# EAGLE design light_controller (EAGLE 8.4.3)
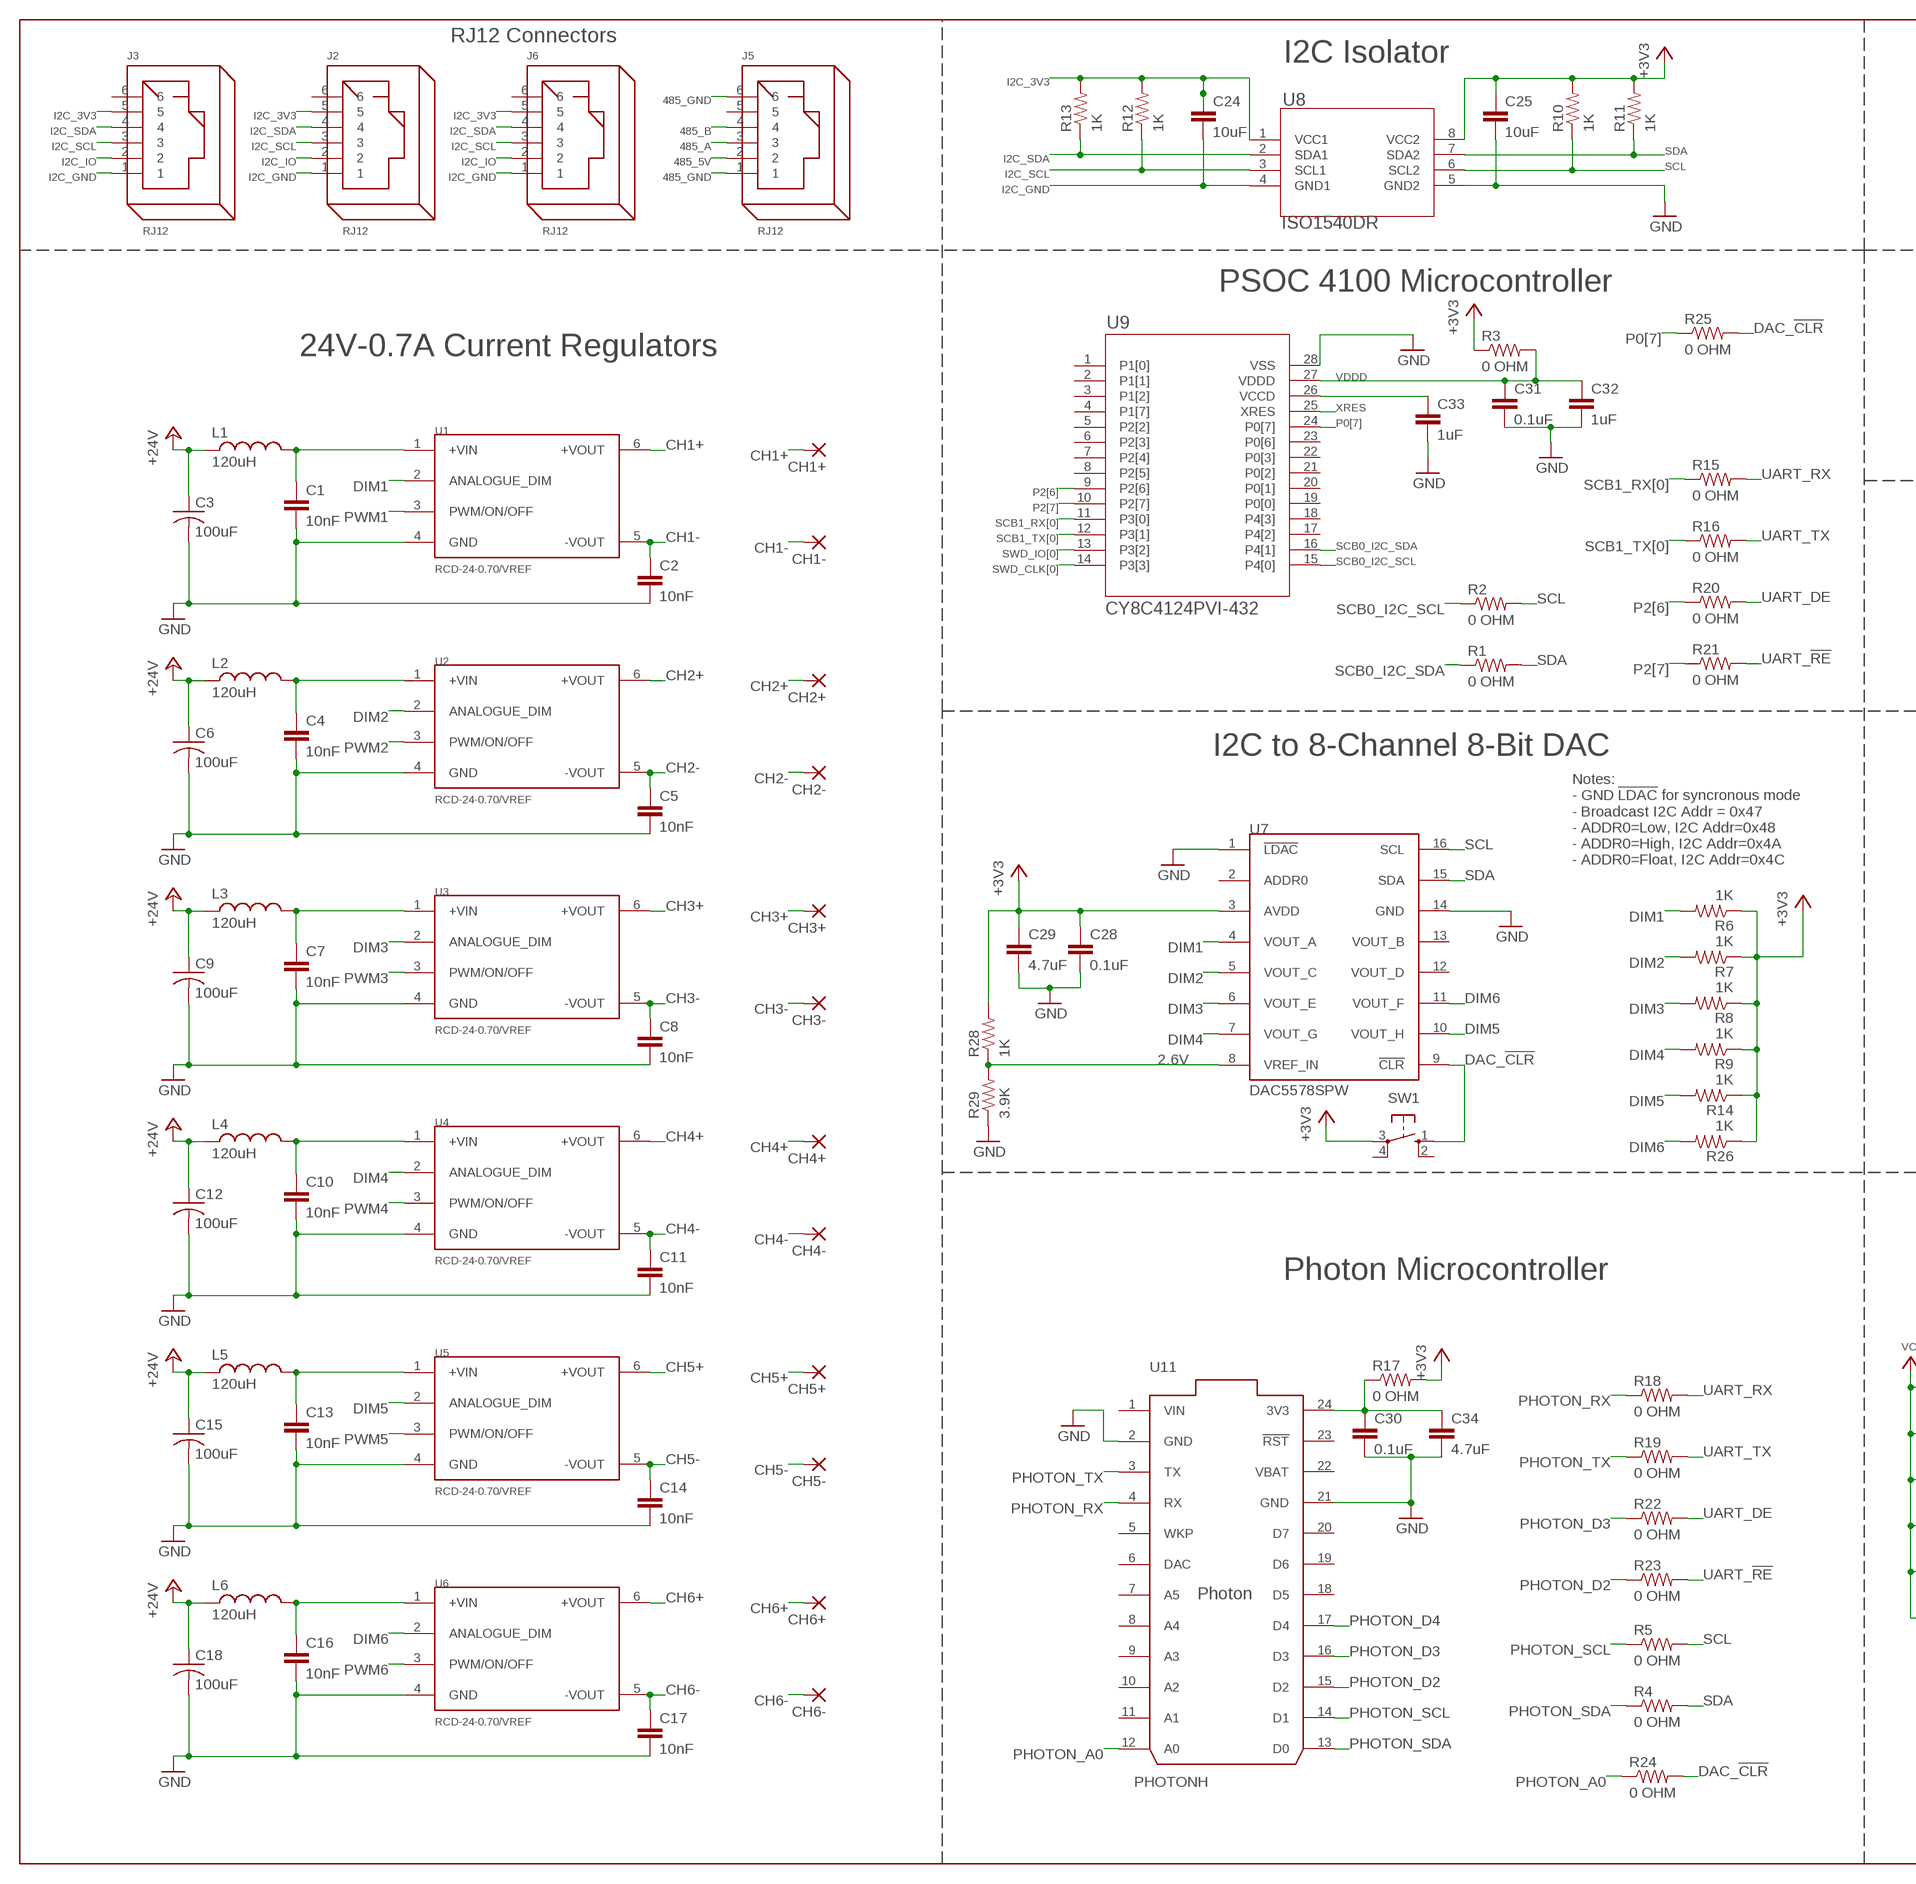
[diagram p0: schematic, sheet 1, part 1 of 2]
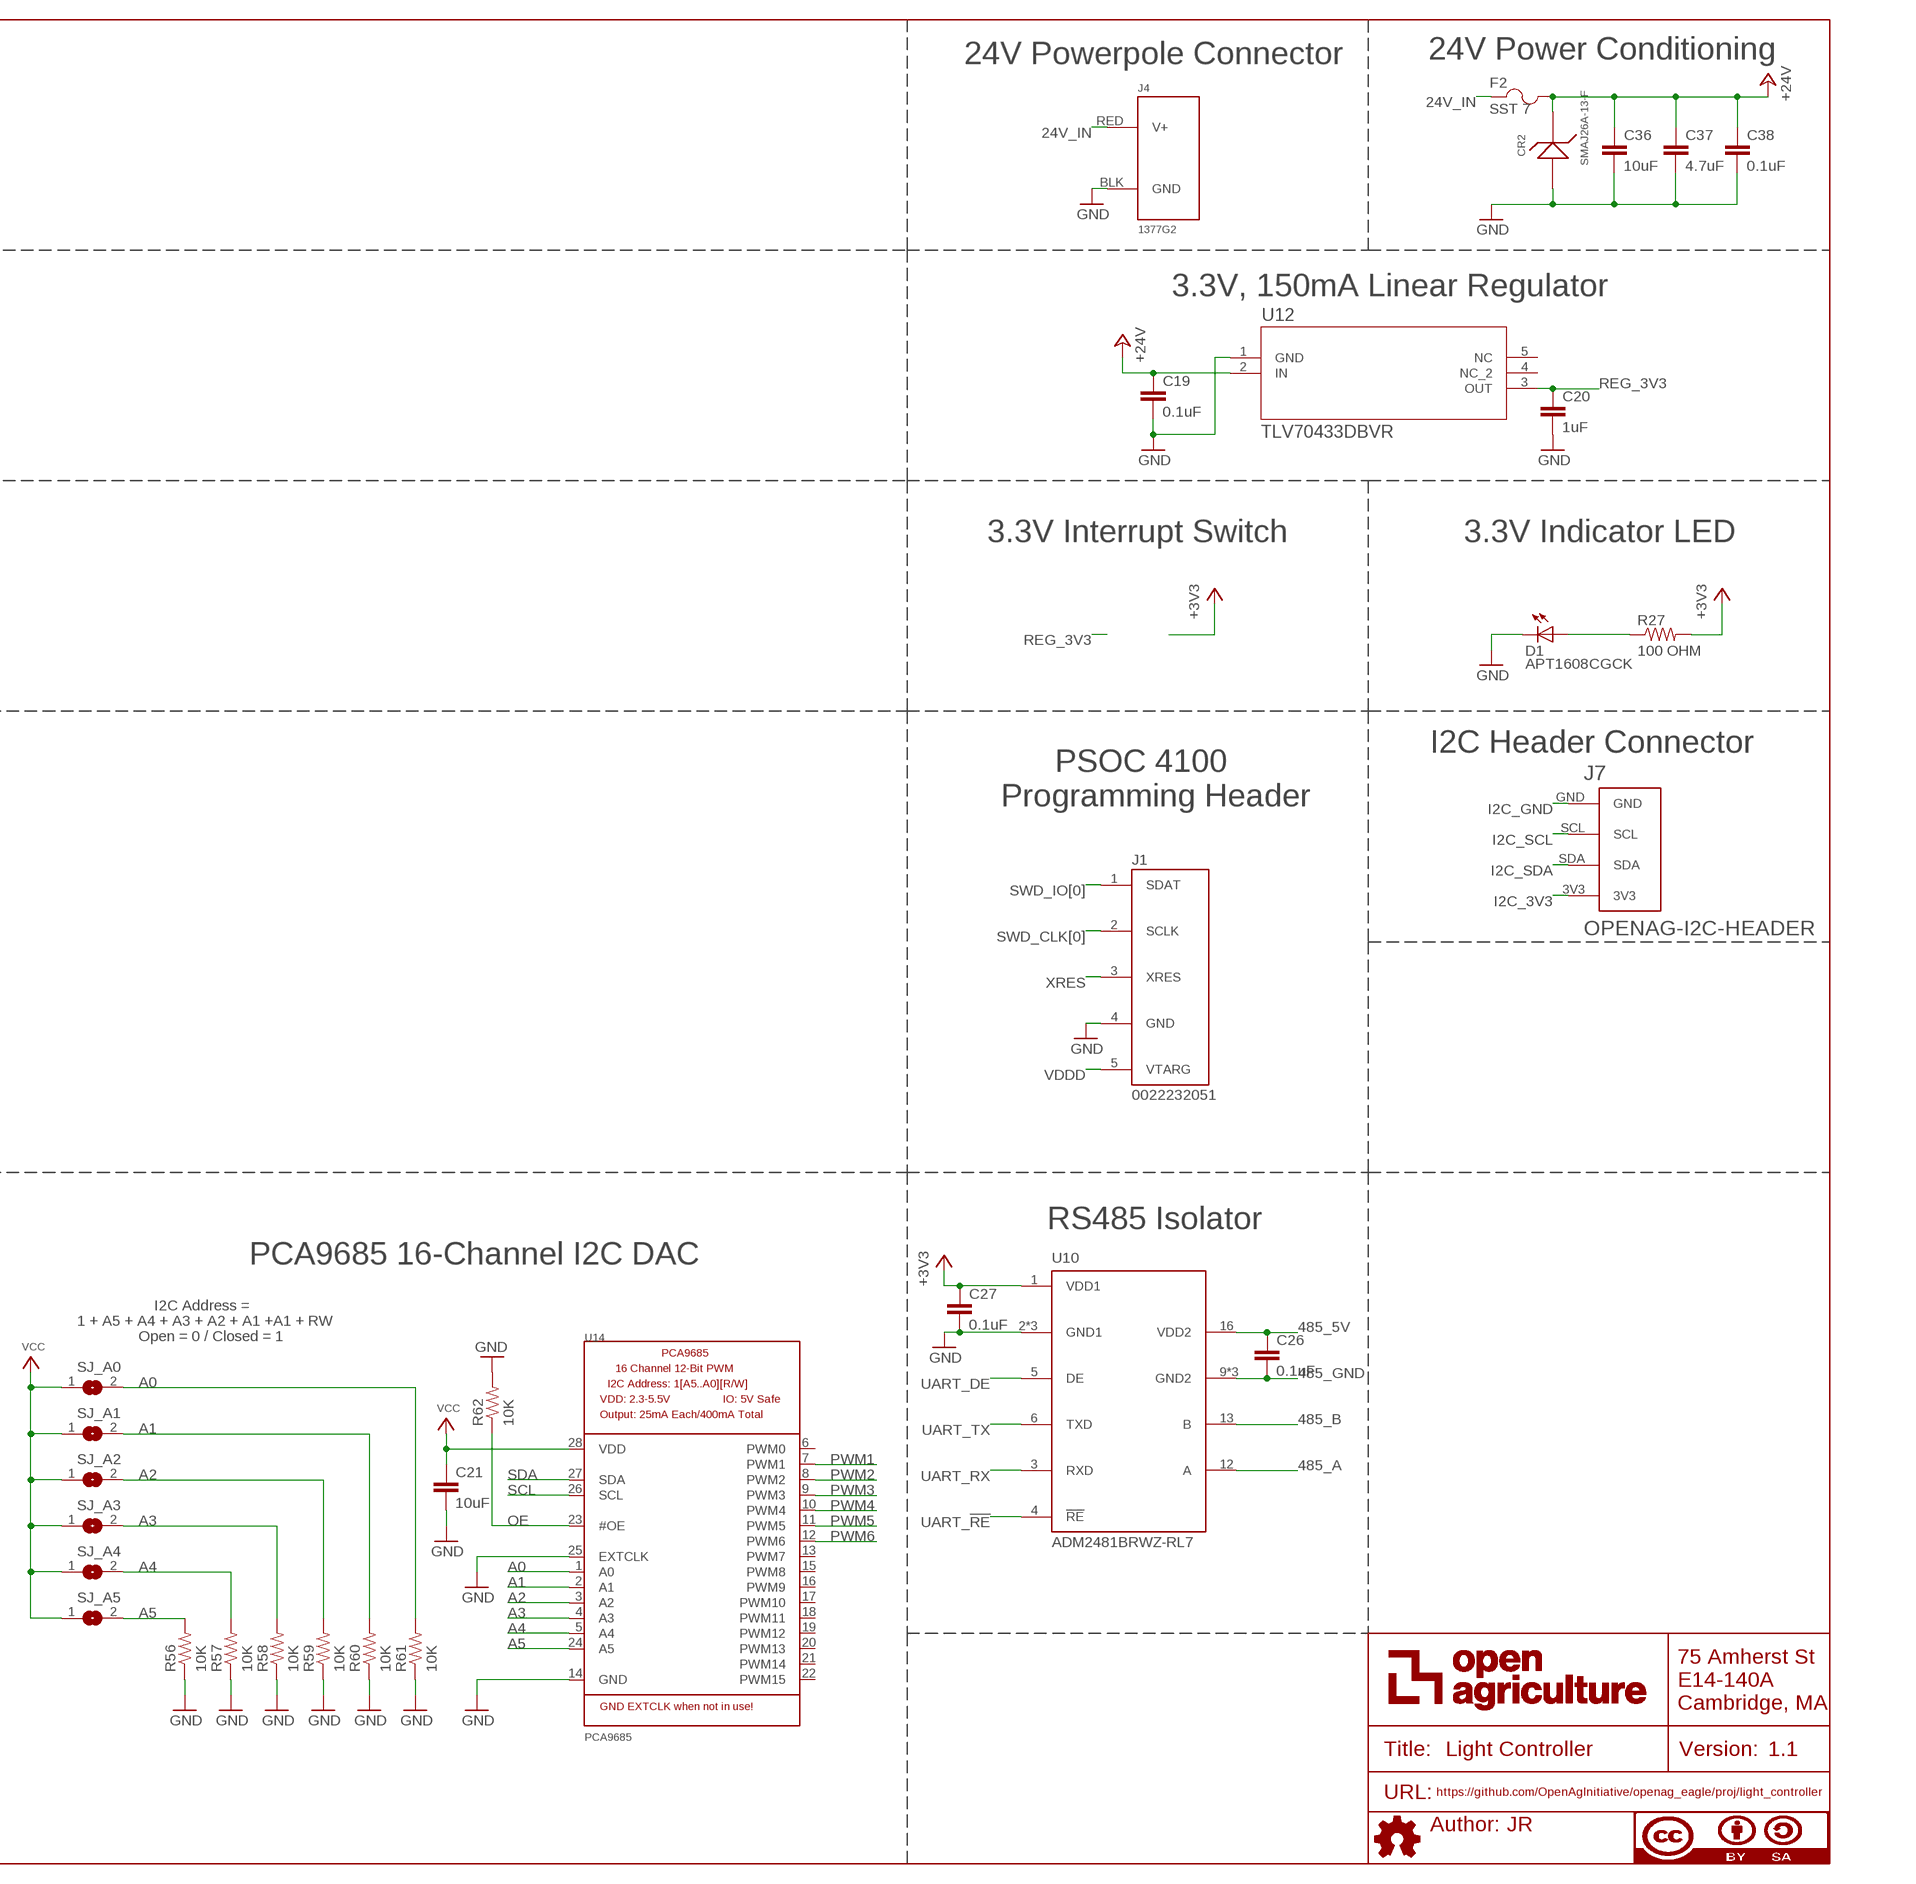
[diagram p1: schematic, sheet 1, part 2 of 2]

## Parts
C1  10nF  10NF-C0603C103K5RACTU  [C0603]
C2  10nF  10NF-C0603C103K5RACTU  [C0603]
C3  100uF  100UF-EEE-1HA101UP  [EEE-1HA101UP]
C4  10nF  10NF-C0603C103K5RACTU  [C0603]
C5  10nF  10NF-C0603C103K5RACTU  [C0603]
C6  100uF  100UF-EEE-1HA101UP  [EEE-1HA101UP]
C7  10nF  10NF-C0603C103K5RACTU  [C0603]
C8  10nF  10NF-C0603C103K5RACTU  [C0603]
C9  100uF  100UF-EEE-1HA101UP  [EEE-1HA101UP]
C10  10nF  10NF-C0603C103K5RACTU  [C0603]
C11  10nF  10NF-C0603C103K5RACTU  [C0603]
C12  100uF  100UF-EEE-1HA101UP  [EEE-1HA101UP]
C13  10nF  10NF-C0603C103K5RACTU  [C0603]
C14  10nF  10NF-C0603C103K5RACTU  [C0603]
C15  100uF  100UF-EEE-1HA101UP  [EEE-1HA101UP]
C16  10nF  10NF-C0603C103K5RACTU  [C0603]
C17  10nF  10NF-C0603C103K5RACTU  [C0603]
C18  100uF  100UF-EEE-1HA101UP  [EEE-1HA101UP]
C19  0.1uF  0.1UF-C0603C104K5RACTU  [C0603]
C20  1uF  1UF-CL10A105KB8NNNC  [C0603]
C21  10uF  10UF-GMK212BBJ106KG-T  [C0805]
C24  10uF  10UF-GMK212BBJ106KG-T  [C0805]
C25  10uF  10UF-GMK212BBJ106KG-T  [C0805]
C26  0.1uF  0.1UF-C0603C104K5RACTU  [C0603]
C27  0.1uF  0.1UF-C0603C104K5RACTU  [C0603]
C28  0.1uF  0.1UF-C0603C104K5RACTU  [C0603]
C29  4.7uF  4.7UF-CL21A475KBQNNNE  [C0805]
C30  0.1uF  0.1UF-C0603C104K5RACTU  [C0603]
C31  0.1uF  0.1UF-C0603C104K5RACTU  [C0603]
C32  1uF  1UF-CL10A105KB8NNNC  [C0603]
C33  1uF  1UF-CL10A105KB8NNNC  [C0603]
C34  4.7uF  4.7UF-CL21A475KBQNNNE  [C0805]
C36  10uF  10UF-GMK212BBJ106KG-T  [C0805]
C37  4.7uF  4.7UF-CL21A475KBQNNNE  [C0805]
C38  0.1uF  0.1UF-C0603C104K5RACTU  [C0603]
CH1+  3,17/1,3  [3,17/1,3]
CH1-  3,17/1,3  [3,17/1,3]
CH2+  3,17/1,3  [3,17/1,3]
CH2-  3,17/1,3  [3,17/1,3]
CH3+  3,17/1,3  [3,17/1,3]
CH3-  3,17/1,3  [3,17/1,3]
CH4+  3,17/1,3  [3,17/1,3]
CH4-  3,17/1,3  [3,17/1,3]
CH5+  3,17/1,3  [3,17/1,3]
CH5-  3,17/1,3  [3,17/1,3]
CH6+  3,17/1,3  [3,17/1,3]
CH6-  3,17/1,3  [3,17/1,3]
CR2  SMAJ26A-13-F  [SMA]
D1  APT1608CGCK  [CHIPLED_0603]
F2  SST 7  SST_7  [SS]
FRAME1  DOCFIELD  [DOCFIELD]
J1  0022232051  MINI-PROG3-5POS-MATING-CONNECTOR  [22-23-2051]
J2  RJ12  A-2004-1-4-LP-N-R  [RJ12]
J3  RJ12  A-2004-1-4-LP-N-R  [RJ12]
J4  1377G2  1377G21377G2  [1377G2]
J5  RJ12  A-2004-1-4-LP-N-R  [RJ12]
J6  RJ12  A-2004-1-4-LP-N-R  [RJ12]
J7  OPENAG-I2C-HEADER  [OPENAG-I2C-HEADER]
L1  120uH  120UH-74404064121  [74404064121]
L2  120uH  120UH-74404064121  [74404064121]
L3  120uH  120UH-74404064121  [74404064121]
L4  120uH  120UH-74404064121  [74404064121]
L5  120uH  120UH-74404064121  [74404064121]
L6  120uH  120UH-74404064121  [74404064121]
R1  0 OHM  0OHM-RC0603JR-070RL  [RC0603N]
R2  0 OHM  0OHM-RC0603JR-070RL  [RC0603N]
R3  0 OHM  0OHM-RC0603JR-070RL  [RC0603N]
R4  0 OHM  0OHM-RC0603JR-070RL  [RC0603N]
R5  0 OHM  0OHM-RC0603JR-070RL  [RC0603N]
R6  1K  1K-ERJ-PB3D1001V  [RC0603N]
R7  1K  1K-ERJ-PB3D1001V  [RC0603N]
R8  1K  1K-ERJ-PB3D1001V  [RC0603N]
R9  1K  1K-ERJ-PB3D1001V  [RC0603N]
R10  1K  1K-ERJ-PB3D1001V  [RC0603N]
R11  1K  1K-ERJ-PB3D1001V  [RC0603N]
R12  1K  1K-ERJ-PB3D1001V  [RC0603N]
R13  1K  1K-ERJ-PB3D1001V  [RC0603N]
R14  1K  1K-ERJ-PB3D1001V  [RC0603N]
R15  0 OHM  0OHM-RC0603JR-070RL  [RC0603N]
R16  0 OHM  0OHM-RC0603JR-070RL  [RC0603N]
R17  0 OHM  0OHM-RC0603JR-070RL  [RC0603N]
R18  0 OHM  0OHM-RC0603JR-070RL  [RC0603N]
R19  0 OHM  0OHM-RC0603JR-070RL  [RC0603N]
R20  0 OHM  0OHM-RC0603JR-070RL  [RC0603N]
R21  0 OHM  0OHM-RC0603JR-070RL  [RC0603N]
R22  0 OHM  0OHM-RC0603JR-070RL  [RC0603N]
R23  0 OHM  0OHM-RC0603JR-070RL  [RC0603N]
R24  0 OHM  0OHM-RC0603JR-070RL  [RC0603N]
R25  0 OHM  0OHM-RC0603JR-070RL  [RC0603N]
R26  1K  1K-ERJ-PB3D1001V  [RC0603N]
R27  100 OHM  100OHM-RC0603JR-07100RL  [RC0603N]
R28  1K  1K-ERJ-PB3D1001V  [RC0603N]
R29  3.9K  3.9K-RC0603JR-073K9L  [RC0603N]
R56  10K  10K-ERJ-3EKF1002V  [RC0603N]
R57  10K  10K-ERJ-3EKF1002V  [RC0603N]
R58  10K  10K-ERJ-3EKF1002V  [RC0603N]
R59  10K  10K-ERJ-3EKF1002V  [RC0603N]
R60  10K  10K-ERJ-3EKF1002V  [RC0603N]
R61  10K  10K-ERJ-3EKF1002V  [RC0603N]
R62  10K  10K-ERJ-3EKF1002V  [RC0603N]
SJ_A0  SOLDERJUMPERREFLOW_NOPASTE  [SOLDERJUMPER_REFLOW_NOPASTE]
SJ_A1  SOLDERJUMPERREFLOW_NOPASTE  [SOLDERJUMPER_REFLOW_NOPASTE]
SJ_A2  SOLDERJUMPERREFLOW_NOPASTE  [SOLDERJUMPER_REFLOW_NOPASTE]
SJ_A3  SOLDERJUMPERREFLOW_NOPASTE  [SOLDERJUMPER_REFLOW_NOPASTE]
SJ_A4  SOLDERJUMPERREFLOW_NOPASTE  [SOLDERJUMPER_REFLOW_NOPASTE]
SJ_A5  SOLDERJUMPERREFLOW_NOPASTE  [SOLDERJUMPER_REFLOW_NOPASTE]
SW1  BF3-1020  [B3F-10XX]
U1  RCD-24-0.70/VREF  [RCD-24-PINNED]
U2  RCD-24-0.70/VREF  [RCD-24-PINNED]
U3  RCD-24-0.70/VREF  [RCD-24-PINNED]
U4  RCD-24-0.70/VREF  [RCD-24-PINNED]
U5  RCD-24-0.70/VREF  [RCD-24-PINNED]
U6  RCD-24-0.70/VREF  [RCD-24-PINNED]
U7  DAC5578SPW  [TSSOP16]
U8  ISO1540DR  [D8]
U9  CY8C4124PVI-432  [SSOP-28]
U10  ADM2481BRWZ-RL7  [SOIC16LWB]
U11  PHOTONH  PHOTONHPHOTONH  [PHOTON]
U12  TLV70433DBVR  TLV70433DBVRDBV5-M  [DBV5-M]
U14  PCA9685  PCA9685PW/Q900,118  [TSSOP28]

## Nets
2.6V: R28.1 R29.2 U7.8(VREF_IN)
24V_IN: F2.1 J4.RED(V+)
485_5V: C26.1 J5.2 U10.16(VDD2)
485_A: J5.3 U10.12(A)
485_B: J5.4 U10.13(B)
485_GND: C26.2 J5.1 J5.6 U10.9(GND2) U10.10(GND2) U10.15(GND2)
+3V3: C25.1 C27.1 C28.1 C29.1 R3.1 R6.1 R7.1 R8.1 R9.1 R10.2 R11.2 R14.1 R17.2 R26.1 R27.2 R28.2 SW1.3(P) U7.3(AVDD) U8.8(VCC2) U10.1(VDD1)
+24V: C3.+(1(+)) C6.+(1(+)) C9.+(1(+)) C12.+(1(+)) C15.+(1(+)) C18.+(1(+)) C19.1 C36.1 C37.1 C38.1 CR2.1 F2.2 L1.1 L2.1 L3.1 L4.1 L5.1 L6.1 U12.2(IN)
A0: R61.2 SJ_A0.2 U14.1(A0)
A1: R60.2 SJ_A1.2 U14.2(A1)
A2: R59.2 SJ_A2.2 U14.3(A2)
A3: R58.2 SJ_A3.2 U14.4(A3)
A4: R57.2 SJ_A4.2 U14.5(A4)
A5: R56.2 SJ_A5.2 U14.24(A5)
CH1+: CH1+.1(P) U1.6(+VOUT)
CH1-: C2.1 CH1-.1(P) U1.5(-VOUT)
CH2+: CH2+.1(P) U2.6(+VOUT)
CH2-: C5.1 CH2-.1(P) U2.5(-VOUT)
CH3+: CH3+.1(P) U3.6(+VOUT)
CH3-: C8.1 CH3-.1(P) U3.5(-VOUT)
CH4+: CH4+.1(P) U4.6(+VOUT)
CH4-: C11.1 CH4-.1(P) U4.5(-VOUT)
CH5+: CH5+.1(P) U5.6(+VOUT)
CH5-: C14.1 CH5-.1(P) U5.5(-VOUT)
CH6+: CH6+.1(P) U6.6(+VOUT)
CH6-: C17.1 CH6-.1(P) U6.5(-VOUT)
DAC_!CLR!: R24.2 R25.2 SW1.1(S) U7.9(!CLR!)
DIM1: R6.2 U1.2(ANALOGUE_DIM) U7.4(VOUT_A)
DIM2: R7.2 U2.2(ANALOGUE_DIM) U7.5(VOUT_C)
DIM3: R8.2 U3.2(ANALOGUE_DIM) U7.6(VOUT_E)
DIM4: R9.2 U4.2(ANALOGUE_DIM) U7.7(VOUT_G)
DIM5: R14.2 U5.2(ANALOGUE_DIM) U7.10(VOUT_H)
DIM6: R26.2 U6.2(ANALOGUE_DIM) U7.11(VOUT_F)
GND: C1.2 C2.2 C3.-(2(-)) C4.2 C5.2 C6.-(2(-)) C7.2 C8.2 C9.-(2(-)) C10.2 C11.2 C12.-(2(-)) C13.2 C14.2 C15.-(2(-)) C16.2 C17.2 C18.-(2(-)) C19.2 C20.2 C21.2 C25.2 C27.2 C28.2 C29.2 C30.2 C31.2 C32.2 C33.2 C34.2 C36.2 C37.2 C38.2 CR2.2 D1.C J1.4(GND) J4.BLK(GND) R29.1 R56.1 R57.1 R58.1 R59.1 R60.1 R61.1 R62.2 U1.4(GND) U2.4(GND) U3.4(GND) U4.4(GND) U5.4(GND) U6.4(GND) U7.1(!LDAC!) U7.14(GND) U8.5(GND2) U9.28(VSS) U10.2(GND1) U10.7(GND1) U10.8(GND1) U11.2(GND) U11.21(GND) U12.1(GND) U14.14(GND) U14.25(EXTCLK)
I2C_3V3: C24.1 J2.5 J3.5 J6.5 J7.3V3 R12.2 R13.2 U8.1(VCC1)
I2C_GND: C24.2 J2.1 J3.1 J6.1 J7.GND U8.4(GND1)
I2C_IO: J2.2 J3.2 J6.2
I2C_SCL: J2.3 J3.3 J6.3 J7.SCL R12.1 U8.3(SCL1)
I2C_SDA: J2.4 J3.4 J6.4 J7.SDA R13.1 U8.2(SDA1)
N$1: C1.1 L1.2 U1.1(+VIN)
N$2: C4.1 L2.2 U2.1(+VIN)
N$3: D1.A R27.1
N$4: C7.1 L3.2 U3.1(+VIN)
N$5: C10.1 L4.2 U4.1(+VIN)
N$6: C13.1 L5.2 U5.1(+VIN)
N$7: C16.1 L6.2 U6.1(+VIN)
N$8: C30.1 C34.1 R17.1 U11.24(3V3)
N$23: C33.1 U9.26(VCCD)
OE: R62.1 U14.23(#OE)
P0[7]: R25.1 U9.24(P0[7])
P2[6]: R20.1 U9.9(P2[6])
P2[7]: R21.1 U9.10(P2[7])
PHOTON_A0: R24.1 U11.12(A0)
PHOTON_D2: R23.1 U11.15(D2)
PHOTON_D3: R22.1 U11.16(D3)
PHOTON_D4: U11.17(D4)
PHOTON_RX: R18.1 U11.4(RX)
PHOTON_SCL: R5.1 U11.14(D1)
PHOTON_SDA: R4.1 U11.13(D0)
PHOTON_TX: R19.1 U11.3(TX)
PWM1: U1.3(PWM/ON/OFF) U14.7(PWM1)
PWM2: U2.3(PWM/ON/OFF) U14.8(PWM2)
PWM3: U3.3(PWM/ON/OFF) U14.9(PWM3)
PWM4: U4.3(PWM/ON/OFF) U14.10(PWM4)
PWM5: U5.3(PWM/ON/OFF) U14.11(PWM5)
PWM6: U6.3(PWM/ON/OFF) U14.12(PWM6)
REG_3V3: C20.1 U12.3(OUT)
SCB0_I2C_SCL: R2.1 U9.15(P4[0])
SCB0_I2C_SDA: R1.1 U9.16(P4[1])
SCB1_RX[0]: R15.1 U9.11(P3[0])
SCB1_TX[0]: R16.1 U9.12(P3[1])
SCL: R2.2 R5.2 R10.1 U7.16(SCL) U8.6(SCL2) U14.26(SCL)
SDA: R1.2 R4.2 R11.1 U7.15(SDA) U8.7(SDA2) U14.27(SDA)
SWD_CLK[0]: J1.2(SCLK) U9.14(P3[3])
SWD_IO[0]: J1.1(SDAT) U9.13(P3[2])
UART_!RE!: R21.2 R23.2 U10.4(!RE!)
UART_DE: R20.2 R22.2 U10.5(DE)
UART_RX: R15.2 R18.2 U10.3(RXD)
UART_TX: R16.2 R19.2 U10.6(TXD)
VCC: C21.1 SJ_A0.1 SJ_A1.1 SJ_A2.1 SJ_A3.1 SJ_A4.1 SJ_A5.1 U14.28(VDD)
VDDD: C31.1 C32.1 J1.5(VTARG) R3.2 U9.27(VDDD)
XRES: J1.3(XRES) U9.25(XRES)
Unconnected: J2.6 J3.6 J5.5 J6.6 SW1.2(S1) SW1.4(P1) U7.2(ADDR0) U7.12(VOUT_D) U7.13(VOUT_B) U9.1(P1[0]) U9.2(P1[1]) U9.3(P1[2]) U9.4(P1[7]) U9.5(P2[2]) U9.6(P2[3]) U9.7(P2[4]) U9.8(P2[5]) U9.17(P4[2]) U9.18(P4[3]) U9.19(P0[0]) U9.20(P0[1]) U9.21(P0[2]) U9.22(P0[3]) U9.23(P0[6]) U11.5(WKP) U11.6(DAC) U11.7(A5) U11.8(A4) U11.9(A3) U11.10(A2) U11.11(A1) U11.18(D5) U11.19(D6) U11.20(D7) U11.23(!RST) U12.4(NC_2) U12.5(NC) U14.6(PWM0) U14.13(PWM7) U14.15(PWM8) U14.16(PWM9) U14.17(PWM10) U14.18(PWM11) U14.19(PWM12) U14.20(PWM13) U14.21(PWM14) U14.22(PWM15)

## Notes on the sheet
- RJ12 Connectors
- I2C Isolator | 24V Powerpole Connector | 24V Power Conditioning
- PSOC 4100 Microcontroller | 3.3V, 150mA Linear Regulator
- 24V-0.7A Current Regulators
- 3.3V Interrupt Switch | 3.3V Indicator LED
- I2C to 8-Channel 8-Bit DAC | I2C Header Connector
- PSOC 4100 
  Programming Header
- Notes:
  - GND !LDAC! for syncronous mode
  - Broadcast I2C Addr = 0x47
  - ADDR0=Low, I2C Addr=0x48
  - ADDR0=High, I2C Addr=0x4A
  - ADDR0=Float, I2C Addr=0x4C
- RS485 Isolator
- PCA9685 16-Channel I2C DAC
- Photon Microcontroller
- I2C Address =
- 1 + A5 + A4 + A3 + A2 + A1 +A1 + RW
- Open = 0 / Closed = 1

## Power pins joined to a net without a drawn wire
VBAT: U11.22(VBAT)
VIN: U11.1(VIN)

## Library data of the parts
C1 C2 C4 C5 C7 C8 C10 C11 C13 C14 C16 C17 = openag-capacitors:10NF-C0603C103K5RACTU: KEMET - C0603C103K5RACTU - CAP CER 10000PF 50V X7R 0603 Description: 10000pF ±10% 50V Ceramic Capacitor X7R 0603 (1608 Metric) Technical Specifications: Capacitance: 10000pF Tolerance: ±10% Voltage - Rated: 50V Temperature Coefficient: X7R Operating Temperature: -55°C ~ 125°C Applications: General Purpose Mounting Type: Surface Mount, MLCC Package / Case: 0603 (1608 Metric) Size / Dimension: 0.063" L x 0.032" W (1.60mm x 0.80mm) Thickness (Max): 0.034" (0.87mm) Datasheet(s): X7R Dielectric, 6.3-250 VDC <https://search.kemet.com/component-edge/download/datasheet/C0603C103K5RACTU.pdf> Vendor(s): Digikey: 399-1091-1-ND <https://www.digikey.com/product-detail/en/kemet/C0603C103K5RACTU/399-1091-1-ND/411366#>; POPULATE: YES; VERIFIED: NO
C3 C6 C9 C12 C15 C18 = openag-capacitors:100UF-EEE-1HA101UP: Panasonic - EEE-1HA101UP - ELECTROLYTIC CAP ALUM 100UF 20% 50V SMD Description: 100µF 50V Aluminum Electrolytic Capacitors Radial, Can - SMD 2000 Hrs @ 85°C Technical Specifications: Capacitance: 100uF Tolerance: ±20% Rated Voltage: 50V Polarization: Polar Operating Temperature: -40°C ~ 85°C Datasheet(s): S Series, Type V <https://industrial.panasonic.com/cdbs/www-data/pdf/RDE0000/ABA0000C1145.pdf> Vendor(s): Digikey: PCE3917CT-ND <https://www.digikey.com/product-detail/en/panasonic-electronic-components/EEE-1HA101UP/PCE3917CT-ND/766293>; POPULATE: YES; VERIFIED: NO
C19 C26-C28 C30 C31 C38 = openag-capacitors:0.1UF-C0603C104K5RACTU: Kemet - C0603C104K5RACTU - CAP CER 0.1UF 50V X7R 0603 Description: 0.1µF ±10% 50V Ceramic Capacitor X7R 0603 (1608 Metric) Technical Specifications: Capacitance: 0.1µF Tolerance: ±10% Rated Voltage: 50V Temperature Coefficient: X7R Operating Temperature: -55°C ~ 125°C Package / Case: 0603 (1608 Metric) Datasheet(s): X7R Dielectric, 6.3-250 VDC <https://search.kemet.com/component-edge/download/datasheet/C0603C104K5RACTU.pdf> Vendor(s): Digikey: 399-5089-1-ND <https://www.digikey.com/product-detail/en/kemet/C0603C104K5RACTU/399-5089-1-ND/1465623>; POPULATE: YES; VERIFIED: NO
C20 C32 C33 = openag-capacitors:1UF-CL10A105KB8NNNC: Samsung - CL10A105KB8NNNC - CAP CER 1UF 50V X5R 0603 Description: 1µF ±10% 50V Ceramic Capacitor X5R 0603 (1608 Metric) Technical Specifications: Capacitance: 1µF Tolerance: ±10% Rated Voltage: 50V Temperature Coefficient: X5R Operating Temperature: -55°C ~ 85°C Packaging / Case: 0603 (1608 Metric) Datasheet(s): CL10A105KB8NNNC Spec <http://www.samsungsem.com/kr/support/product-search/mlcc/CL10A105KB8NNNC.jsp> Vendor(s): Digikey: 1276-1860-1-ND <https://www.digikey.com/product-detail/en/samsung-electro-mechanics-america-inc/CL10A105KB8NNNC/1276-1860-1-ND/3889946>; POPULATE: YES; VERIFIED: NO
C21 C24 C25 C36 = openag-capacitors:10UF-GMK212BBJ106KG-T: Taiyo Yuden - GMK212BBJ106KG-T - CAP CER 10UF 35V X5R 0805 Description: 10µF ±10% 35V Ceramic Capacitor X5R 0805 (2012 Metric) Technical Specifications: Capacitance: 10µF Tolerance: ±10% Rated Voltage: 35V Temperature Coefficient: X5R Operating Temperature: -55°C ~ 85°C Package / Case: 0805 (2012 Metric) Datasheet(s): GMK212BBJ106KG-T Spec <http://ds.yuden.co.jp/TYCOMPAS/ut/detail.do?productNo=GMK212BBJ106KG-T&fileName=GMK212BBJ106KG-T_SS&mode=specSheetDownload> Vendor(s): Digikey: 587-4893-1-ND <https://www.digikey.com/product-detail/en/taiyo-yuden/GMK212BBJ106KG-T/587-4893-1-ND/6563736>; POPULATE: YES; VERIFIED: NO
C29 C34 C37 = openag-capacitors:4.7UF-CL21A475KBQNNNE: Samsung - CL21A475KBQNNNE - CAP CER 4.7UF 50V X5R 0805 Description: 4.7µF ±10% 50V Ceramic Capacitor X5R 0805 (2012 Metric) Technical Specifications: Capacitance: 4.7uF Tolerance: ±10% Rated Voltage: 50V Temperature Coefficient: X5R Operating Temperature: -55°C ~ 85°C Package/Case: 0805 (2012 Metric) Datasheet(s): CL21A475KBQNNNE Characteristics <http://www.samsungsem.com/kr/front/downloadcms.do?path=/kr/support/product-search/mlcc/__icsFiles/afieldfile/2014/11/05&fileName=C_CL21A475KBQNNNE.pdf> Vendor(s): Digikey: 1276-1248-1-ND <https://www.digikey.com/product-detail/en/samsung-electro-mechanics/CL21A475KBQNNNE/1276-1248-1-ND/3889334>; POPULATE: YES; VERIFIED: NO
CH1+ CH1- CH2+ CH2- CH3+ CH3- CH4+ CH4- CH5+ CH5- CH6+ CH6- = openag-wirepads:3,17/1,3: THROUGH-HOLE PAD
CR2 = openag-diodes:SMAJ26A-13-F: Diodes Incorporated - SMAJ26A-13-F - TVS DIODE 26VWM 42.1VC SMA Description: TVS DIODE 26VWM 42.1VC SMA Technical Specifications: Type: Zener Voltage - Reverse Standoff (Typ): 26V Voltage - Breakdown (Min): 28.9V Voltage - Clamping (Max) @ Ipp: 42.1V Current - Peak Pulse (10/1000µs): 9.5A Power - Peak Pulse: 400W Power Line Protection: No Operating Temperature: -55°C ~ 150°C (TJ) DO-214AC, SMA Datasheet(s): SMAJ5.0(C)A - SMAJ200(C)A Vendor(s): Digikey: SMAJ26A-FDICT-ND <https://www.digikey.com/product-detail/en/diodes-incorporated/SMAJ26A-13-F/SMAJ26A-FDICT-ND/806583>; POPULATE: YES; VERIFIED: NO
D1 = openag-diodes:APT1608CGCK: Kingbright - APT1608CGCK - LED GREEN CLEAR 0603 SMD Description: Green 570nm LED Indication - Discrete 2.1V 0603 (1608 Metric) Technical Specifications: Color: Green Lens Color: Colorless Lens Transparency: Clear Millicandela Rating: 50mcd Lens Style/Size: Rectangle with Flat Top, 1.20mm x 0.80mm Voltage - Forward (Vf) (Typ): 2.1V Current - Test: 20mA Viewing Angle: 120° Mounting Type: Surface Mount Wavelength - Dominant: 570nm Wavelength - Peak: 574nm Package / Case: 0603 (1608 Metric) Supplier Device Package: Chip LED Size / Dimension: 1.60mm L x 0.80mm W Height (Max): 0.75mm Datasheet(s): APT1608CGCK <http://www.kingbrightusa.com/images/catalog/SPEC/APT1608CGCK.pdf> Vendor(s): Digikey: 754-1116-1-ND <https://www.digikey.com/product-detail/en/kingbright/APT1608CGCK/754-1116-1-ND/1747833#>; POPULATE: YES; VERIFIED: NO
F2 = openag-fuses:SST_7: Bel Fuse - SST7 - FUSE BRD MNT 7A 125VAC/VDC 2SMD Description: FUSE BRD MNT 7A 125VAC/VDC 2SMD Technical Specifications: Current Rating: 7A Voltage Rating: 125V Fuse Type: Board Mount (Cartridge Style Excluded) Mounting Type: Surface Mount Operating Temperature: -55°C ~ 125°C Datasheet(s): SST Type <https://belfuse.com/resources/StewartConnector/SST.pdf> Vendor(s): Digikey: 507-1072-1-ND <https://www.digikey.com/product-detail/en/bel-fuse-inc/SST-7/507-1072-1-ND/615026>; POPULATE: YES; VERIFIED: NO
FRAME1 = openag-frames:DOCFIELD: DOCUMENT FIELD; AUTHOR: JR; TITLE: Light Controller; URL: https://github.com/OpenAgInitiative/openag_eagle/proj/light_controller; VER: 1.1
J1 = openag-connectors:MINI-PROG3-5POS-MATING-CONNECTOR: Molex - 0022232051 - CONN HEADER 5POS .100 VERT TIN Description: 5 Positions Header Connector 0.100" (2.54mm) Through Hole Tin This is the specified mating connector for programming a PSOC microcontroller with the MiniProg3 Programmer Technical Specifications: Connector Type: Header Contact Type: Male Pin Pitch - Mating: 0.100" (2.54mm) Number of Positions: 5 Number of Rows: 1 Mounting Type: Through Hole Fastening Type: Friction Lock Datasheet(s): Molex 22-23-2051 <http://www.molex.com/pdm_docs/sd/022232051_sd.pdf> Cypress CY8CKIT-002 Brief <http://www.cypress.com/file/44091/download> Vendor(s): Digikey: WM4203-ND (Molex Connector) <https://www.digikey.com/products/en?keywords=22-23-2051> Digikey: 428-2975-ND (Cypress Programmer Kit) <https://www.digikey.com/product-detail/en/cypress-semiconductor-corp/CY8CKIT-002/428-2975-ND/2126344>; POPULATE: YES; VERIFIED: NO
J2 J3 J5 J6 = openag-connectors:A-2004-1-4-LP-N-R: Assmann WSW Components - A-2004-1-4-LP-N-R - RJ12 CONN MOD JACK 6P6C R/A UNSHLD Description: Jack Modular Connector 6p6c (RJ11, RJ12, RJ14, RJ25) 90° Angle (Right) Unshielded Technical Specifications: Connector Type: Jack Number of Positions/Contacts: 6p6c (RJ11, RJ12, RJ14, RJ25) Number of Ports: 1 Number of Rows: 1 Mounting Type: Through Hole Orientation: 90° Angle (Right) Termination: Solder Shielding: Unshielded Features: Board Lock LED Color: Does Not Contain LED Tab Direction: Down Contact Material: Phosphor Bronze Contact Finish: Gold Contact Finish Thickness: 6µin (0.152µm) Housing Material: Polybutylene Terephthalate (PBT), Glass Filled Operating Temperature: -40°C ~ 85°C Datasheet(s): A-2004-1-4-LP-N Drawing <http://www.assmann-wsw.com/fileadmin/datasheets/ASS_7320_CO.pdf> Vendor(s): Digikey: AE10383-ND <https://www.digikey.com/product-detail/en/assmann-wsw-components/A-2004-1-4-LP-N-R/AE10383-ND/2183634>; POPULATE: YES; VERIFIED: NO
J4 = openag-connectors:1377G2: Anderson Powerpole - 1377G2 - RT. ANGLE 25A THRU-HOLE PCB CONTACT PAIR FOR 15/45 HOUSING Description: Heavy Duty Power Connectors PP PCB .40/1.295 RT.ANG.CONT. short one Technical Specifications: Current Rating: 25A Voltage Rating: 600 V Datasheet(s): 1377G2 Datasheet <http://www.mouser.com/ds/2/22/ds-pp1545-766098.pdf> Vendor(s): Mouser: 879-1377G2 <https://www.mouser.com/ProductDetail/Anderson-Power-Products/1377G2/?qs=sGAEpiMZZMtjzVbpKqo2YZRH3O%252bLIhj7rfgcv2%2febyE%3d>; POPULATE: YES; VERIFIED: NO
J7 = openag-connectors:OPENAG-I2C-HEADER: Fits standard 100 mil header footprint; POPULATE: NO; VERIFIED: NO
L1-L6 = openag-inductors:120UH-74404064121: Wurth Electronics - 74404064121 - FIXED IND 120UH 790MA 520 MOHM Technical Specifications: Inductance: 120uH Rated Current: 790mA Saturation Current: 980mA DC Resistance: 520mΩ Operating Temperature: -40° C to 125°C Datasheet(s): 74404064121 Drawing <http://katalog.we-online.de/pbs/datasheet/74404064121.pdf> Vendors: Digikey: 732-7258-1-ND <https://www.digikey.com/product-detail/en/wurth-electronics-inc/74404064121/732-7258-1-ND/5353238>; POPULATE: YES; VERIFIED: NO
R1-R5 R15-R25 = openag-resistors:0OHM-RC0603JR-070RL: Yageo - RC0603JR-070RL - RES SMD 0 OHM JUMPER 1/10W 0603 Description: 0 Ohms Jumper 0.1W, 1/10W Chip Resistor 0603 (1608 Metric) Moisture Resistant Thick Film Technical Specifications: Resistance: 0 Ohms Power: 0.1W, 1/10W Operating Temperature: -55°C ~ 155°C Package / Case: 0603 (1608 Metric) Datasheet(s): RC Series, L Datasheet <http://www.yageo.com/documents/recent/PYu-RC_Group_51_RoHS_L_8.pdf> Vendor(s): Digikey: 311-0.0GRCT-ND <https://www.digikey.com/product-detail/en/yageo/RC0603JR-070RL/311-0.0GRCT-ND/729622>; POPULATE: YES; VERIFIED: NO
R6-R14 R26 R28 = openag-resistors:1K-ERJ-PB3D1001V: Panasonic - P20283CT-ND - RES SMD 1K OHM 0.5% 1/5W 0603 Description: 1 kOhms ±0.5% 0.2W, 1/5W Chip Resistor 0603 (1608 Metric) Automotive AEC-Q200, Pulse Withstanding Thick Film Technical Specifications: Resistance: 1 kOhms Tolerance: ±0.5% Power: 0.2W, 1/5W Operating Temperature: -55°C ~ 155°C Package / Case: 0603 (1608 Metric) Datasheet(s): ERJ-PB3, PB6 Series, High Precision Datasheet <https://industrial.panasonic.com/cdbs/www-data/pdf/RDM0000/AOA0000C328.pdf> Vendor(s): Digikey: P20283CT-ND <https://www.digikey.com/product-detail/en/panasonic-electronic-components/ERJ-PB3D1001V/P20283CT-ND/6214538>; POPULATE: YES; VERIFIED: NO
R27 = openag-resistors:100OHM-RC0603JR-07100RL: Yageo - RC0603JR-07100RL - RES SMD 100 OHM 5% 1/10W 0603 Description: 100 Ohms ±5% 0.1W, 1/10W Chip Resistor 0603 (1608 Metric) Moisture Resistant Thick Film Technical Specifications: Resistance: 100 Ohms Tolerance: ±5% Power (Watts): 0.1W, 1/10W Composition: Thick Film Features: Moisture Resistant Temperature Coefficient: ±100ppm/°C Operating Temperature: -55°C ~ 155°C Package / Case: 0603 (1608 Metric) Supplier Device Package: 0603 Size / Dimension: 0.063" L x 0.032" W (1.60mm x 0.80mm) Height - Seated (Max): 0.022" (0.55mm) Number of Terminations: 2 Datasheet(s): Thick Film Chip Resistor Intro <http://www.yageo.com.tw/exep/pages/download/literatures/PYu-R_INT-thick_7.pdf> Chip Resistor Marking <http://www.yageo.com/exep/pages/download/literatures/PYu-R_Marking_2.pdf> RC Series, L Datasheet <http://www.yageo.com/documents/recent/PYu-RC_Group_51_RoHS_L_8.pdf> Vendor(s): Digikey: 311-100GRCT-ND <https://www.digikey.com/product-detail/en/yageo/RC0603JR-07100RL/311-100GRCT-ND/729644>; POPULATE: YES; VERIFIED: NO
R29 = openag-resistors:3.9K-RC0603JR-073K9L: Yageo - RC0603JR-073K9L - RES SMD 3.9K OHM 5% 1/10W 0603 Description: 3.9 kOhms ±5% 0.1W, 1/10W Chip Resistor 0603 (1608 Metric) Moisture Resistant Thick Film Technical Specifications: Resistance: 3.9 kOhms Tolerance: ±5% Power (Watts): 0.1W, 1/10W Composition: Thick Film Features: Moisture Resistant Temperature Coefficient: ±100ppm/°C Operating Temperature: -55°C ~ 155°C Package / Case: 0603 (1608 Metric) Supplier Device Package: 0603 Size / Dimension: 0.063" L x 0.032" W (1.60mm x 0.80mm) Height - Seated (Max): 0.022" (0.55mm) Number of Terminations: 2 Datasheet(s): Thick Film Chip Resistor Intro <http://www.yageo.com.tw/exep/pages/download/literatures/PYu-R_INT-thick_7.pdf> Chip Resistor Marking <http://www.yageo.com/exep/pages/download/literatures/PYu-R_Marking_2.pdf> RC Series, L Datasheet <http://www.yageo.com/documents/recent/PYu-RC_Group_51_RoHS_L_8.pdf> Vendor(s): Digikey: 311-3.9KGRCT-ND <https://www.digikey.com/product-detail/en/yageo/RC0603JR-073K9L/311-3.9KGRCT-ND/729710>; POPULATE: YES; VERIFIED: NO
R56-R62 = openag-resistors:10K-ERJ-3EKF1002V: Panasonic - ERJ-3EKF1002V - RES SMD 10K OHM 1% 1/10W 0603 Description: 10 kOhms ±1% 0.1W, 1/10W Chip Resistor 0603 (1608 Metric) Automotive AEC-Q200 Thick Film Technical Specifications: Resistance: 10kOhms Tolerance: ±1% Power: 0.1W, 1/10W Operating Temperature: -55°C ~ 155°C Package/Case: 0603 (1608 Metric) Datasheet(s): ERJ-3EKF1002V View All Specifications <https://industrial.panasonic.com/ww/products/resistors/chip-resistors/general-purpose-chip-resistors/precision-thick-film-chip-resistors/ERJ3EKF1002V> Vendor(s): Digikey: P10.0KHCT-ND <https://www.digikey.com/product-detail/en/panasonic-electronic-components/ERJ-3EKF1002V/P10.0KHCT-ND/198102>; POPULATE: YES; VERIFIED: NO
SJ_A0 SJ_A1-SJ_A5 = openag-connectors:SOLDERJUMPER: SMD Solder JUMPER Solder the two pads together to create a connection, or remove the solder to break it. REFLOW - Use this footprint for solder paste and reflow ovens. WAVE - Use this footprint for hand-soldering (larger pads). CLOSED - Has a trace between the two pads to ensure it is closed by default. The trace needs to be cut to disable the jumper, and can be closed again by creating a solder bridge between the two pads.; POPULATE: YES; VERIFIED: NO
SW1 = openag-switches:BF3-1020: Omron - BF3-1020 -SWITCH TACTILE SPST-NO 0.05A 24V Description: Tactile Switch SPST-NO Top Actuated Through Hole Technical Specifications: Circuit: SPST-NO Switch Function: Off-Mom Contact Rating @ Voltage: 0.05A @ 24VDC Mounting Type: Through Hole Switch Travel: 0.25mm Mechanical Life: 1,000,000 Cycles Operating Temperature: -25°C ~ 70°C Datasheet(s): B3F Series Datasheet <http://omronfs.omron.com/en_US/ecb/products/pdf/en-b3f.pdf> Vendor(s): Digikey: SW402-ND <https://www.digikey.com/products/en?keywords=B3F-1020>; POPULATE: YES; VERIFIED: NO
U1-U6 = openag-regulators:RCD-24-0.70/VREF: Recom Power - RCD-24-0.70/VREF - LED SUPPLY CC BUCK 2-35V 700MA Description: 700mA 2 ~ 35 V Constant Current LED Driver Buck Topology 1 Output Technical Specifications: Type: Constant Current Topology: Buck Number of Outputs: 1 Voltage - Input (Min): 4.5V Voltage - Input (Max): 36V Voltage - Output: 2 ~ 35 V Current - Output (Max): 700mA Power (Watts): 25W Dimming: Analog Features: SCP Operating Temperature: -40°C ~ 71°C Efficiency: 96% Mounting Type: Through Hole Package / Case: 6-DIP Module Size / Dimension: 0.87" L x 0.49" W x 0.33" H (22.1mm x 12.6mm x 8.5mm) Approvals: cULus Weight: 0.01 lb (4.54g) Datasheet(s): RCD-24 Series Datasheet <https://www.recom-power.com/pdf/Lightline/RCD-24.pdf> Vendor(s): Digikey: 945-1806-5-ND <https://www.digikey.com/product-detail/en/recom-power/RCD-24-0.70-VREF/945-1806-5-ND/2613767>; POPULATE: YES; VERIFIED: NO
U7 = openag-dacs:DAC5578SPW: Texas Instruments - DAC5578SPW Description: 8 Bit Digital to Analog Converter 8 16-TSSOP Technical Specifications: Number of Bits: 8-bit Number of D/A Converters: 8 Settling Time: 12us Operating Voltage: 2.7V - 5.5V Operating Temperature: -40° C to 125°C Max IDD (Normal Mode): 1.4mA Output Short Circuit Current (Individual): 25mA Datasheet(s): DAC5578,6578,7578 <http://www.ti.com/lit/ds/symlink/dac5578.pdf> Vendor(s): Digikey: 296-27736-5-ND <https://www.digikey.com/product-detail/en/texas-instruments/DAC5578SPW/296-27736-5-ND/2360827>; POPULATE: YES; VERIFIED: NO
U8 = openag-isolators:ISO1540DR: Texas Instruments - ISO1540DR - DGTL ISO 2.5KV 2CH I2C 8SOIC Description: I²C Digital Isolator 2500Vrms 2 Channel 1Mbps 25kV/µs CMTI 8-SOIC (0.154", 3.90mm Width) Technical Specifications: Technology: Capacitive Coupling Type: I²C Number of Channels: 2 Channel Type: Bidirectional Voltage-Isolation: 2500Vrms Voltage - Supply: 3 V ~ 5.5 V Data Rate: 1Mbps Operating Temperature: -40°C ~ 125°C Package / Case: 8-SOIC (0.154", 3.90mm Width) Max Supply Current (3V ≤ VCC1, VCC2 ≤ 3.6V) Side 1, Side 2: 3.8mA, 3.1mA Datasheet(s): ISO154x <http://www.ti.com/lit/ds/symlink/iso1540.pdf> Vendor(s): Digikey: 296-34871-1-ND <https://www.digikey.com/product-detail/en/texas-instruments/ISO1540DR/296-34871-1-ND/3587214>; POPULATE: YES; VERIFIED: NO
U9 = openag-microcontrollers:CY8C4124PVI-432: Cypress - CY8C4124PVI-432 - IC MCU 32BIT 16KB FLASH 28SSOP Description: ARM® Cortex®-M0 PSOC® 4 CY8C41xx Microcontroller IC 32-Bit 24MHz 16KB (16K x 8) FLASH 28-SSOP Technical Specifications: Core Processor: ARM® Cortex®-M0 Core Size: 32-Bit Core Speed: 24 MHz Connectivity: I²C, IrDA, LIN, Microwire, SmartCard, SPI, SSP, UART/USART Peripherals: Brown-out Detect/Reset, LVD, POR, PWM, WDT Number of IO: 24 Program Memory Size: 16KB (16K x 8) Program Memory Type: FLASH RAM Size: 4K x 8 Supply Voltage: 1.71 V ~ 5.5 V Data Converters: A/D 8x12b Oscillator Type: Internal Operating Temperature: -40°C ~ 85°C (TA) Package / Case: 28-SSOP (0.209", 5.30mm Width) Datasheet(s): PSoC 4100 Family <http://www.cypress.com/file/138651/download> Vendor(s): Digikey: 428-3348-ND <https://www.digikey.com/product-detail/en/cypress-semiconductor-corp/CY8C4124PVI-432/428-3348-ND/4895074>; POPULATE: YES; VERIFIED: NO
U10 = openag-isolators:ADM2481BRWZ-RL7: Analog Devices - ADM2481BRWZ-RL7 - DGTL ISO RS422/RS485 16SOIC Description: RS422, RS485 Digital Isolator 2500Vrms 3 Channel 500kbps 25kV/µs CMTI 16-SOIC (0.295", 7.50mm Width) Technical Specifications: Technology: Magnetic Coupling Type: RS422, RS485 Isolated Power: No Number of Channels: 3 Inputs - Side 1/Side 2: 2/1 Channel Type: Bidirectional Voltage - Isolation: 2500Vrms Common Mode Transient Immunity (Min): 25kV/µs Data Rate: 500kbps Rise / Fall Time (Typ): 600ns, 600ns (Max) Supply Voltage: 3.3 V ~ 5 V Operating Temperature: -40°C ~ 85°C Package / Case: 16-SOIC (0.295", 7.50mm Width) Datasheet(s): ADM2481 <http://www.analog.com/media/en/technical-documentation/data-sheets/ADM2481.pdf> Vendor(s): Digikey: ADM2481BRWZ-RL7TR-ND <https://www.digikey.com/product-detail/en/analog-devices-inc/ADM2481BRWZ-RL7/ADM2481BRWZ-RL7TR-ND/2606655>
U11 = openag-microcontrollers:PHOTONH: PARTICLE - PHOTONH - Tiny Wi-Fi dev board w/cloud backend Description: The Photon is a $19 tiny Wi-Fi development kit for creating connected projects and products for the Internet of Things. It's easy to use, it's powerful, and it's connected to the cloud. Technical Specifications: Processor: STM32F205RGY6 120Mhz ARM Cortex M3 Wireless: 802.11b/g/n Wi-Fi Peripherals: Digital(x18), ADC(x8), DAC(x2), SPI(x2), I2S(x1), I2C(x1) SPI, CAN(1), USB(1), PWM(9) Memory: 1MB flash, 128KB RAM Cerfifications: FCC, CE and IC Operating Temperature: -20°C ~ 60°C Humidity Range: Non condensing, relative humidity: 95% Supply Input Voltage (VIN): 3.6V ~ 5.5V Supply Input Voltage (3V3): 3.0V ~ 3.6V Max Supply Output Current (VIN): 1A Max Supply Output Current (3V3): 100mA Average Operating Current (WiFi on, @VIN): up to 100mA Peak Operating Current (WiFi on, @VIN): up to 430mA I/O Max Source/Sink Current (Individual): 25mA I/O Max Source/Sinnk Current (Total): 120mA Datasheet(s): Photon Datasheet <https://docs.particle.io/datasheets/photon-datasheet/> Vendor(s): Particle: PHOTONH <https://store.particle.io/products/photon>; POPULATE: YES; VERIFIED: NO
U12 = openag-regulators:TLV70433DBVR: Texas Instruments - TLV70433DBVR - IC REG LINEAR 3.3V 150MA SOT23-5 Description: Linear Voltage Regulator IC Positive Fixed 1 Output 3.3V 150mA SOT-23-5 Technical Specifications: Output Configuration: Positive Output Type: Fixed Number of Regulators: 1 Voltage - Input (Max): 24V Voltage - Output (Min/Fixed): 3.3V Voltage Dropout (Max): 1.1V @ 100mA Current - Output: 150mA Current - Quiescent (Iq): 4.5µA Current - Supply (Max): 5.5µA PSRR: 60dB (100kHz) Protection Features: Over Current, Reverse Polarity Operating Temperature: -40°C ~ 125°C Mounting Type: Surface Mount Package / Case: SC-74A, SOT-753 Supplier Device Package: SOT-23-5 Datasheet(s): TLV704xx <http://www.ti.com/lit/ds/symlink/tlv704.pdf> Vendor(s): Digikey: 296-39285-1-ND <https://www.digikey.com/product-detail/en/texas-instruments/TLV70433DBVR/296-39285-1-ND/5143276>; POPULATE: YES; VERIFIED: NO
U14 = openag-pwm:PCA9685PW/Q900,118: NXP USA Inc. - PCA9685PW/Q900,118 - IC LED DRVR LIN DIM 25MA 28TSSOP Description: LED Driver IC 16 Output Linear PWM Dimming 25mA 28-TSSOP Technical Specifications: Type: Linear Internal Switch(s): Yes Number of Outputs: 16 Voltage - Supply (Min): 2.3V Voltage - Supply (Max): 5.5V Voltage - Output: 5.5V Current - Output / Channel: 25mA Dimming: PWM Applications: Backlight Operating Temperature: -40°C ~ 85°C (TA) Mounting Type: Surface Mount Package / Case: 28-TSSOP (0.173", 4.40mm Width) Supplier Device Package: 28-TSSOP Base Part Number: PCA9685 Datasheet(s): LED Controllers Leaflet <http://www.nxp.com/documents/leaflet/75016950.pdf> PCA9685 <https://www.nxp.com/docs/en/data-sheet/PCA9685.pdf> Vendor(s): Digikey: 568-5931-1-ND <https://www.digikey.com/product-detail/en/nxp-usa-inc/PCA9685PW-Q900118/568-5931-1-ND/2531218>

## Board
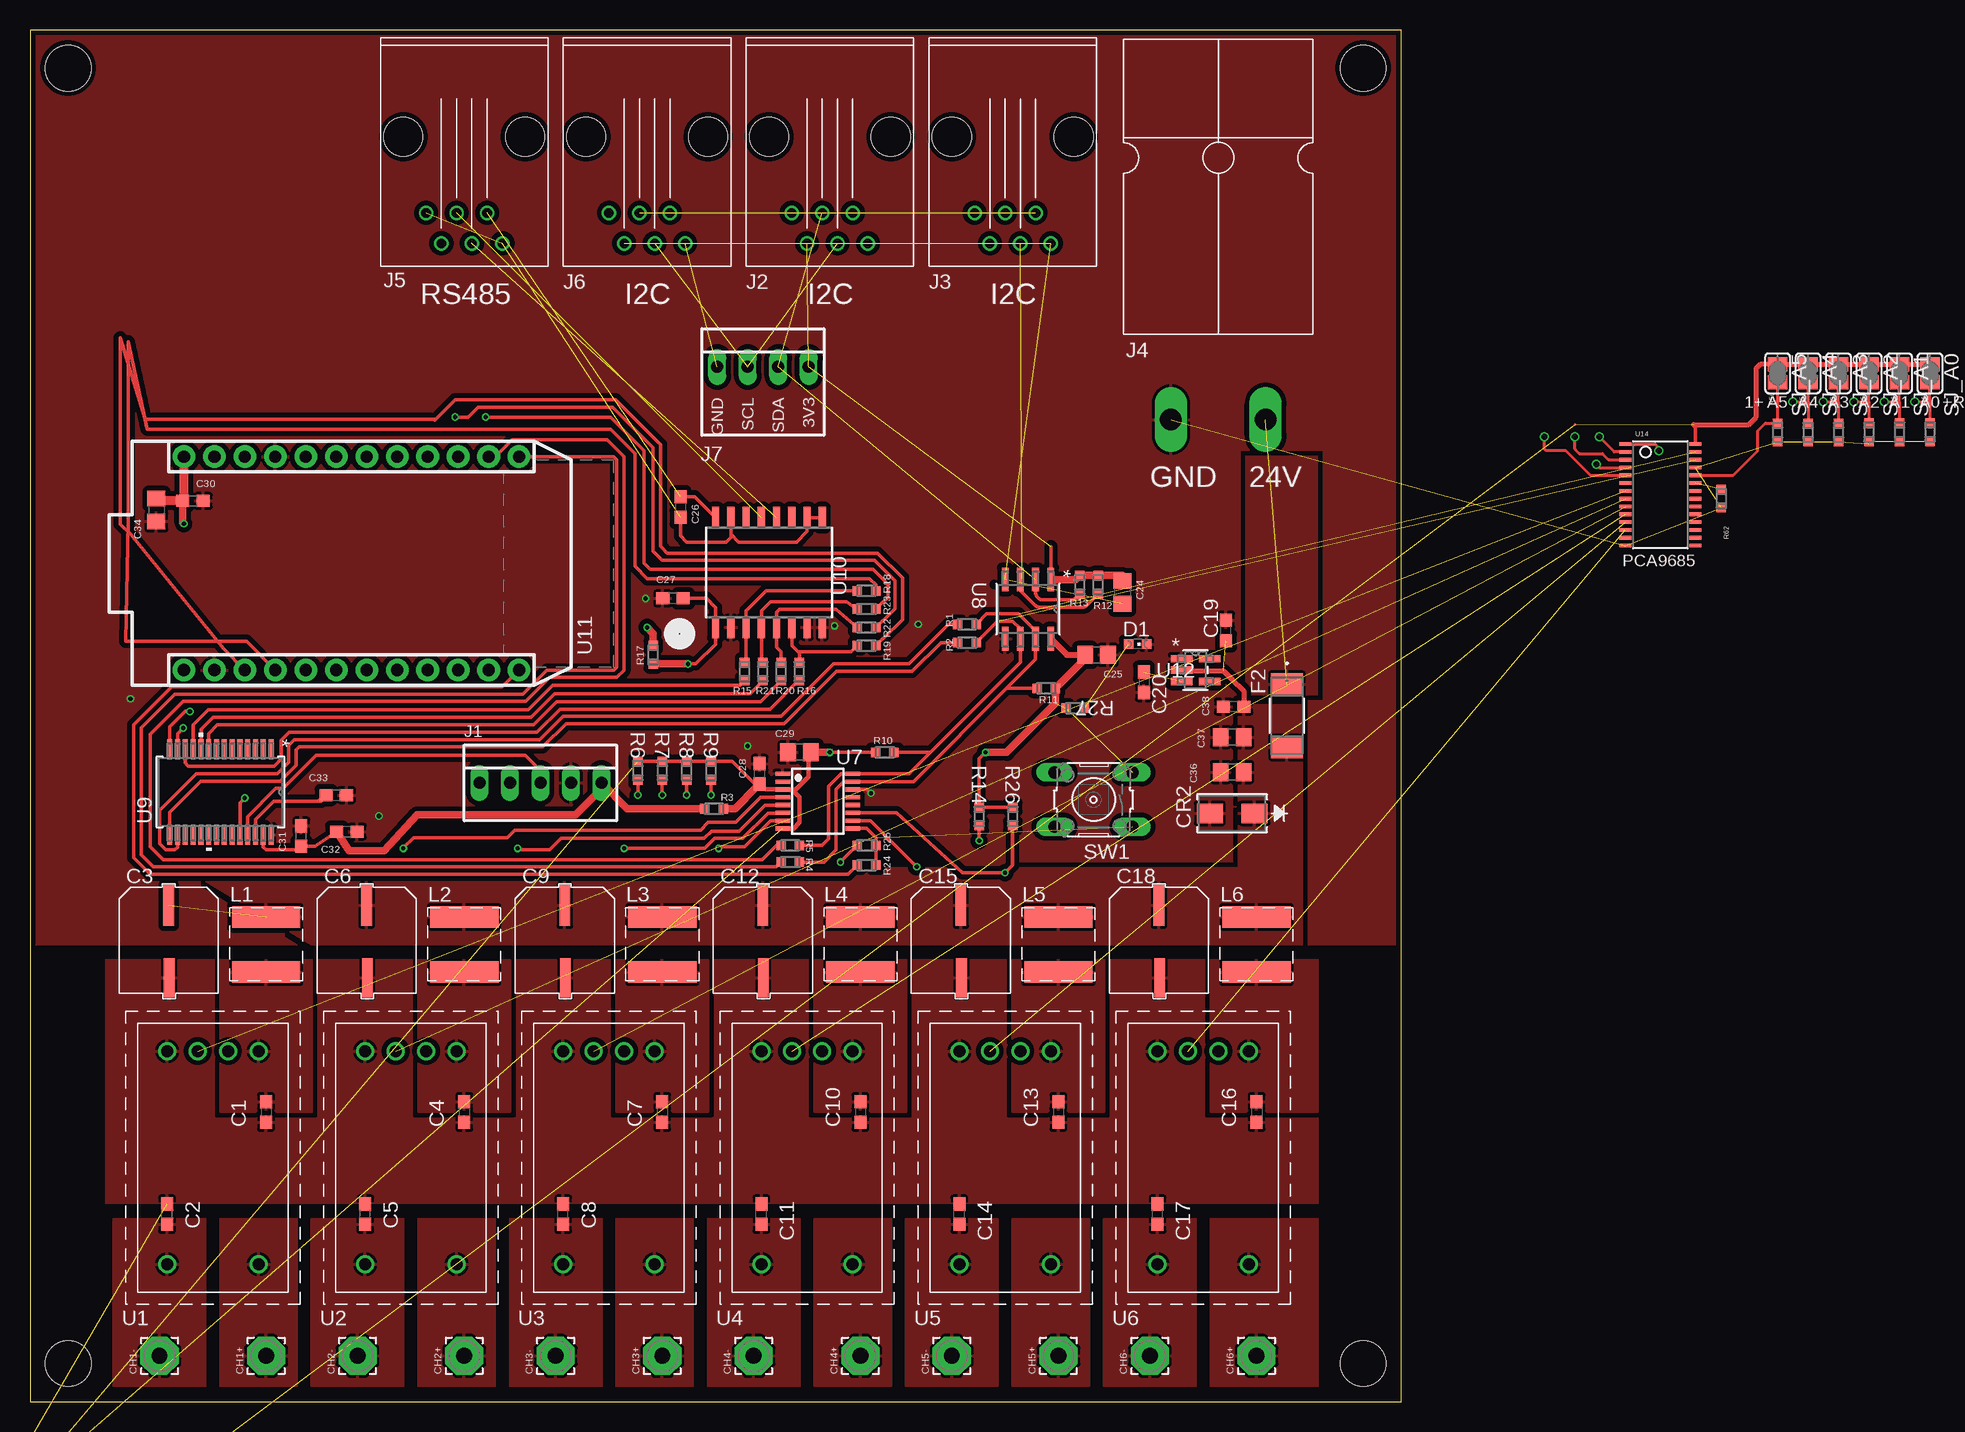
[diagram p2: board, top side]
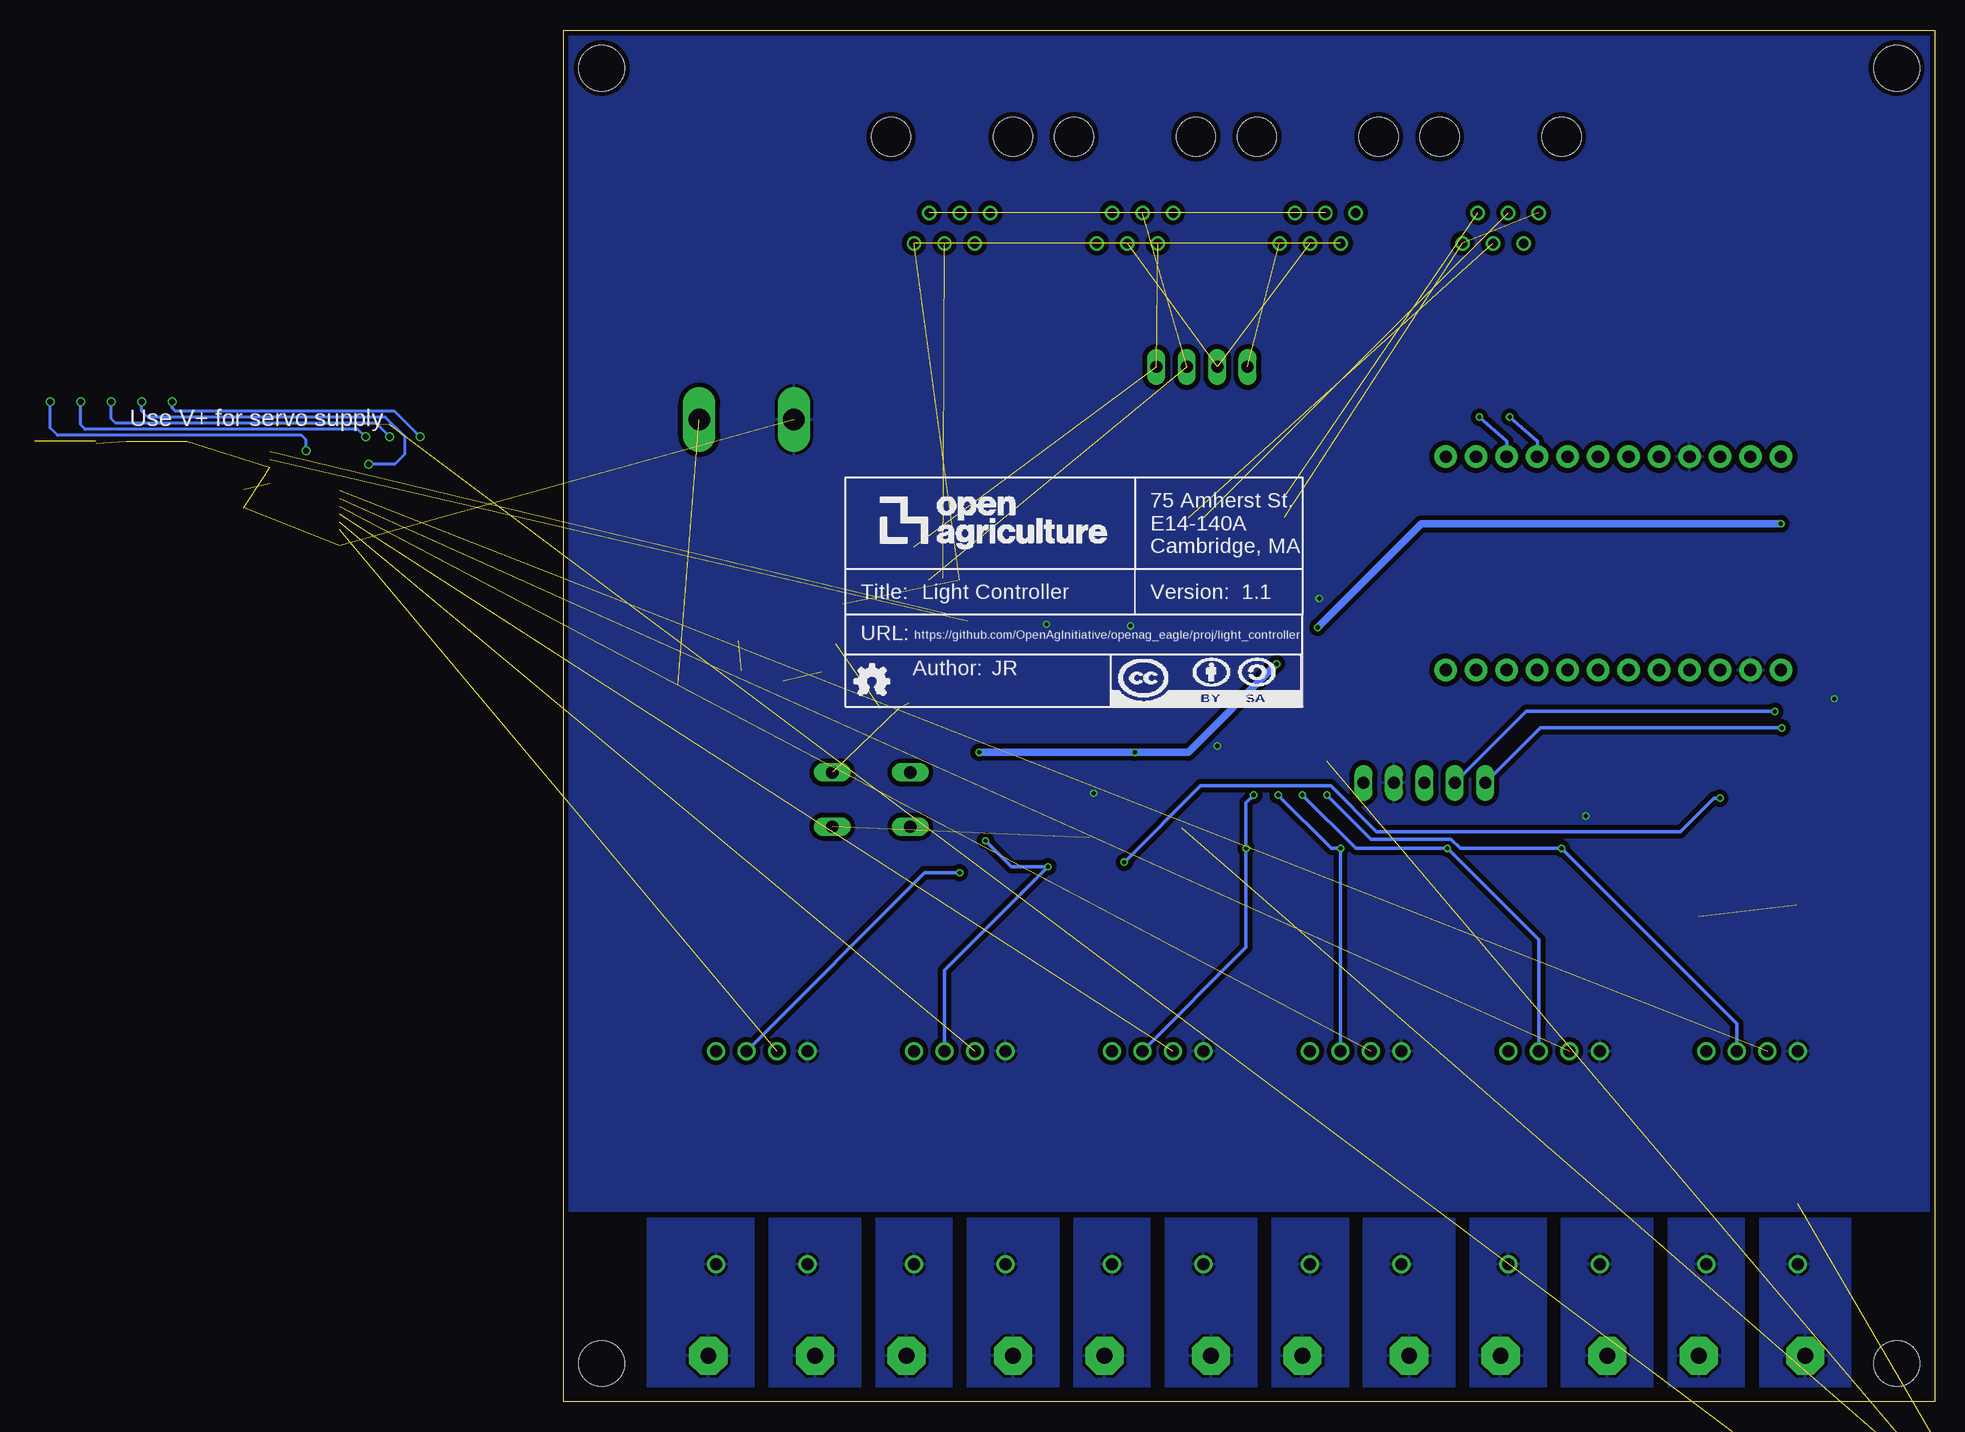
[diagram p3: board, bottom side, seen from below]

Size 114.3 x 114.3 mm. Coordinates in mm from the lower left corner, seen from the top.
Outline: 0,0 114.3,0 114.3,114.3 0,114.3 0,0
Copper layers (1*16): Top 0.035559375mm / dielectric 1.6mm / Bottom 0.035559375mm
Design rules "openag-router": minimum track width 6mil, minimum drill 10mil, track to track 16mil, track to pad 16mil, pad to pad 16mil, via to via 16mil, smd to smd 16mil, copper to edge 15mil, drill to drill 6mil, minimum pad ring 5mil, minimum via ring 5mil, stop-mask expansion 2.5mil, vias tented up to drill 20mil, thermal gap 10mil
Holes 3.81 mm at 3.17,3.17 3.17,111.12 111.12,3.17 111.12,111.12
tRestrict: 4 lines

### Footprints (pad centres in the part's own frame; a part is rotated, then mirrored left to right if it is on the bottom)
C0603 = smd 1.1 x 1: 1 -0.85,0; 2 0.85,0
EEE-1HA101UP = smd 0.889 x 3.404: + 0,-3.251 | smd 0.889 x 3.251: - -0.051,2.794
C0805 = smd 1.3 x 1.5: 1 -0.95,0; 2 0.95,0
3,17/1,3 = drill 1.321 pad 3.175 octagon: 1 0,0
SMA = smd 2.18 x 1.63: 1 -1.857,0; 2 1.857,0
CHIPLED_0603 = smd 0.8 x 0.8: A 0,-0.75; C 0,0.75
SS = smd 1.803 x 2.642: 1 -2.629,0; 2 2.629,0
22-23-2051 = drill 1 long: 1 -5.08,0; 2 -2.54,0; 3 0,0; 4 2.54,0; 5 5.08,0
RJ12 = drill 0.8: 1 -8.89,-3.175; 2 -6.35,-1.905; 3 -8.89,-0.635; 4 -6.35,0.635; 5 -8.89,1.905; 6 -6.35,3.175 | hole 3.25: 0,-5.08; 0,5.08
1377G2 = drill 1.8 long: BLK -3.95,-7.1; RED 3.95,-7.1
OPENAG-I2C-HEADER = drill 1 long: 3V3 3.81,0; GND -3.81,0; SCL -1.27,0; SDA 1.27,0
74404064121 = smd 1.8 x 5.7: 1 -2.3,0; 2 2.3,0
RC0603N = smd 0.756 x 0.8: 1 -0.778,0; 2 0.778,0
SOLDERJUMPER_REFLOW_NOPASTE = smd 1.168 x 1.6: 1 -0.762,0; 2 0.762,0
B3F-10XX = drill 1.016 long: 1 -3.251,2.261; 2 3.251,2.261; 3 -3.251,-2.261; 4 3.251,-2.261
RCD-24-PINNED = drill 1: 1 0,0; 2 0,-2.54; 3 0,-5.08; 4 0,-7.62; 5 17.78,-7.62; 6 17.78,0
TSSOP16 = smd 0.35 x 1.2: 1 -2.275,-2.925; 2 -1.625,-2.925; 3 -0.975,-2.925; 4 -0.325,-2.925; 5 0.325,-2.925; 6 0.975,-2.925; 7 1.625,-2.925; 8 2.275,-2.925; 9 2.275,2.925; 10 1.625,2.925; 11 0.975,2.925; 12 0.325,2.925; 13 -0.325,2.925; 14 -0.975,2.925; 15 -1.625,2.925; 16 -2.275,2.925
D8 = smd 1.981 x 0.559: 1 -2.464,1.905; 2 -2.464,0.635; 3 -2.464,-0.635; 4 -2.464,-1.905; 5 2.464,-1.905; 6 2.464,-0.635; 7 2.464,0.635; 8 2.464,1.905
SSOP-28 = smd 1.651 x 0.432: 1 -3.581,4.225; 2 -3.581,3.575; 3 -3.581,2.925; 4 -3.581,2.275; 5 -3.581,1.625; 6 -3.581,0.975; 7 -3.581,0.325; 8 -3.581,-0.325; 9 -3.581,-0.975; 10 -3.581,-1.625; 11 -3.581,-2.275; 12 -3.581,-2.925; 13 -3.581,-3.575; 14 -3.581,-4.225; 15 3.581,-4.225; 16 3.581,-3.575; 17 3.581,-2.925; 18 3.581,-2.275; 19 3.581,-1.625; 20 3.581,-0.975; 21 3.581,-0.325; 22 3.581,0.325; 23 3.581,0.975; 24 3.581,1.625; 25 3.581,2.275; 26 3.581,2.925; 27 3.581,3.575; 28 3.581,4.225
SOIC16LWB = smd 0.6 x 1.8: 1 -4.445,-4.575; 2 -3.175,-4.575; 3 -1.905,-4.575; 4 -0.635,-4.575; 5 0.635,-4.575; 6 1.905,-4.575; 7 3.175,-4.575; 8 4.445,-4.575; 9 4.445,4.575; 10 3.175,4.575; 11 1.905,4.575; 12 0.635,4.575; 13 -0.635,4.575; 14 -1.905,4.575; 15 -3.175,4.575; 16 -4.445,4.575
PHOTON = drill 1.016 pad 1.88: 1 1.27,32.258; 2 1.27,29.718; 3 1.27,27.178; 4 1.27,24.638; 5 1.27,22.098; 6 1.27,19.558; 7 1.27,17.018; 8 1.27,14.478; 9 1.27,11.938; 10 1.27,9.398; 11 1.27,6.858; 12 1.27,4.318; 13 19.05,4.318; 14 19.05,6.858; 15 19.05,9.398; 16 19.05,11.938; 17 19.05,14.478; 18 19.05,17.018; 19 19.05,19.558; 20 19.05,22.098; 21 19.05,24.638; 22 19.05,27.178; 23 19.05,29.718; 24 19.05,32.258
DBV5-M = smd 1.778 x 0.61: 1 -1.168,0.95; 2 -1.168,0; 3 -1.168,-0.95; 4 1.168,-0.95; 5 1.168,0.95
TSSOP28 = smd 0.305 x 0.991: 1 -4.225,-2.918; 2 -3.575,-2.918; 3 -2.925,-2.918; 4 -2.275,-2.918; 5 -1.625,-2.918; 6 -0.975,-2.918; 7 -0.325,-2.918; 8 0.325,-2.918; 9 0.975,-2.918; 10 1.625,-2.918; 11 2.275,-2.918; 12 2.925,-2.918; 13 3.575,-2.918; 14 4.225,-2.918; 15 4.225,2.918; 16 3.575,2.918; 17 2.925,2.918; 18 2.275,2.918; 19 1.625,2.918; 20 0.975,2.918; 21 0.325,2.918; 22 -0.325,2.918; 23 -0.975,2.918; 24 -1.625,2.918; 25 -2.275,2.918; 26 -2.925,2.918; 27 -3.575,2.918; 28 -4.225,2.918

### Placement (x,y rotation side)
C1  19.68,24.13 270 top
C2  11.43,15.62 90 top
C3  11.56,38.1 180 top
C4  36.2,24.13 270 top
C5  27.94,15.62 90 top
C6  28.07,38.1 180 top
C7  52.7,24.13 270 top
C8  44.45,15.62 90 top
C9  44.58,38.1 180 top
C10  69.22,24.13 270 top
C11  60.96,15.62 90 top
C12  61.09,38.1 180 top
C13  85.72,24.13 270 top
C14  77.47,15.62 90 top
C15  77.6,38.1 180 top
C16  102.23,24.13 270 top
C17  93.98,15.62 90 top
C18  94.11,38.1 180 top
C19  99.69,64.26 90 top
C20  92.84,59.94 270 top
C21  -7.62,-21.59 0 top  (outside the outline)
C24  91.06,67.44 270 top
C25  88.9,62.23 0 top
C26  54.23,74.55 270 top
C27  53.59,66.93 180 top
C28  60.83,52.32 90 top
C29  64.14,54.1 180 top
C30  13.59,75.06 0 top
C31  22.61,47.12 90 top
C32  26.42,47.5 0 top
C33  25.53,50.55 0 top
C34  10.54,74.3 270 top
C36  100.2,52.45 180 top
C37  100.2,55.37 180 top
C38  100.33,57.91 180 top
CH1+  19.68,3.81 90 top
CH1-  10.79,3.81 90 top
CH2+  36.2,3.81 90 top
CH2-  27.3,3.81 90 top
CH3+  52.7,3.81 90 top
CH3-  43.81,3.81 90 top
CH4+  69.22,3.81 90 top
CH4-  60.33,3.81 90 top
CH5+  85.72,3.81 90 top
CH5-  76.83,3.81 90 top
CH6+  102.23,3.81 90 top
CH6-  93.34,3.81 90 top
CR2  100.2,49.02 180 top
D1  92.33,63.12 270 top
F2  104.78,57.15 270 top
FRAME1  90.81,57.91 0 bottom
J1  42.55,51.56 0 top
J2  66.67,105.41 90 top
J3  81.92,105.41 90 top
J4  99.05,88.94 0 top
J5  36.2,105.41 90 top
J6  51.44,105.41 90 top
J7  61.09,86.23 0 top
L1  19.68,38.1 270 top
L2  36.2,38.1 270 top
L3  52.7,38.1 270 top
L4  69.22,38.1 270 top
L5  85.72,38.1 270 top
L6  102.23,38.1 270 top
R1  78.11,64.77 0 top
R2  78.11,63.25 0 top
R3  57.02,49.4 180 top
R4  63.37,44.96 0 top
R5  63.37,46.35 0 top
R6  50.67,52.58 270 top
R7  52.7,52.58 270 top
R8  54.74,52.58 270 top
R9  56.77,52.58 270 top
R10  71.25,54.1 180 top
R11  84.71,59.44 0 top
R12  89.03,68.07 90 top
R13  87.5,68.07 90 top
R14  79.12,48.77 270 top
R15  59.56,60.83 90 top
R16  64.14,60.83 90 top
R17  51.94,62.23 270 top
R18  69.72,67.56 180 top
R19  69.72,62.99 180 top
R20  62.61,60.83 90 top
R21  61.09,60.83 90 top
R22  69.72,64.52 180 top
R23  69.72,66.04 180 top
R24  69.72,44.7 0 top
R25  69.72,46.35 0 top
R26  81.92,48.77 270 top
R27  87.12,57.78 180 top
R28  -6.86,-13.46 0 top  (outside the outline)
R29  -6.86,-16.26 0 top  (outside the outline)
R56  145.67,80.76 90 top  (outside the outline)
R57  148.21,80.76 90 top  (outside the outline)
R58  150.75,80.76 90 top  (outside the outline)
R59  153.29,80.79 90 top  (outside the outline)
R60  155.83,80.79 90 top  (outside the outline)
R61  158.37,80.79 90 top  (outside the outline)
R62  140.97,75.25 270 top  (outside the outline)
SJ_A0  158.37,85.69 270 top  (outside the outline)
SJ_A1  155.83,85.69 270 top  (outside the outline)
SJ_A2  153.29,85.69 270 top  (outside the outline)
SJ_A3  150.75,85.69 270 top  (outside the outline)
SJ_A4  148.21,85.69 270 top  (outside the outline)
SJ_A5  145.67,85.69 270 top  (outside the outline)
SW1  88.65,50.16 180 top
U1  19.05,29.21 270 top
U2  35.56,29.21 270 top
U3  52.07,29.21 270 top
U4  68.58,29.21 270 top
U5  85.09,29.21 270 top
U6  101.6,29.21 270 top
U7  65.66,50.04 270 top
U8  83.19,66.04 270 top
U9  15.88,50.8 270 top
U10  61.59,69.09 0 top
U11  45.09,59.69 90 top
U12  97.16,60.96 0 top
U14  135.89,75.56 270 top  (outside the outline)

### Tracks (layer width: path | path; a pad name or v marks a point on that pad's centre or on a via)
2.6V  (2 unrouted)
24V_IN  (1 unrouted)
  pour Top (isolate 0.406): 107.31,78.74 101.35,78.74 101.35,58.93 107.31,58.93
485_5V  (1 unrouted)
  Top 0.305: C26.1 55.41,75.4 U10.16
485_A  (1 unrouted)
  Top 0.305: U10.12 62.23,73.34
485_B  (1 unrouted)
  Top 0.305: U10.13 60.96,73.61
485_GND  (2 unrouted)
  Top 0.305: C26.2 54.23,72.14 54.74,71.63 58.04,71.63 58.42,72.01 U10.15 58.42,72.26 59.05,71.63 63.88,71.63 64.77,72.52 U10.10 U10.9
+3V3  (via drill 0.35)  (3 unrouted)
  Top 0.305: R10.2 v66.67,54.1 | R6.1 R7.1 R8.1 R9.1 58.53,53.36 60.62,51.26 | R26.1 R14.1 79.12,53.57 v79.65,54.1 | C27.1 56.39,66.93 57.15,66.17 U10.1 57.15,63.12 55.5,61.47 v54.86,61.47
  Top 0.356: 62.74,47.75 63.63,47.75 64.14,48.26 64.14,50.35 63.51,50.97 | 63.51,50.97 62.78,50.97 U7.3 61.29,51.01 C28.1 | 63.51,50.97 63.8,50.97 64.9,52.07 64.9,53.91 C29.1
  Top 0.508: U8.8 86.44,62.23 C25.1
  Top 0.61: v66.67,54.1 C29.1 | v54.86,61.47 51.96,61.47 R17.2 | R3.1 58.76,49.4 60.62,51.26 C28.1 | C25.1 87.95,61.9 R11.2 85.49,58.18 81.41,54.1 v79.65,54.1
  Bottom 0.61: v54.86,61.47 62.23,54.1 v66.67,54.1 v79.65,54.1
+24V  (2 unrouted)
  Top 0.406: U12.2 96.02,60.92 99.47,60.92 100.19,60.2 100.2,60.2 101.18,59.22 C38.1
  pour Top (isolate 0.406): 23.5,38.1 23.5,44.45 7.62,53.98 7.62,47.62
  pour Top (isolate 0.406): 40.01,38.1 40.01,44.45 23.5,44.45 23.5,38.1
  pour Top (isolate 0.406): 56.52,38.1 56.52,44.45 40.01,44.45 40.01,38.1
  pour Top (isolate 0.406): 73.03,38.1 73.03,44.45 56.52,44.45 56.52,38.1
  pour Top (isolate 0.406): 89.53,38.1 89.53,44.45 73.03,44.45 73.03,38.1
  pour Top (isolate 0.406): 106.05,38.1 106.05,44.45 89.53,44.45 89.53,38.1
  pour Top (isolate 0.406): 106.05,43.18 106.05,58.04 100.71,58.04 100.71,43.18
A0  (via drill 0.5)
  Top 0.254: 158.37,83.31 SJ_A0.2 | v157.1,83.31 158.37,83.31 | 158.37,83.31 R61.2 | v135.76,79.25 135.76,79.5 135.47,79.79 U14.1
  Bottom 0.254: v157.1,83.31 157.1,81.15 156.46,80.52 136.14,80.52 135.76,80.14 v135.76,79.25
A1  (via drill 0.5)
  Top 0.254: 155.83,83.31 SJ_A1.2 | v154.56,83.31 155.83,83.31 | 155.83,83.31 R60.2 | U14.2 132.06,79.14 v130.81,80.39
  Bottom 0.254: v154.56,83.31 154.56,81.41 154.18,81.03 131.44,81.03 v130.81,80.39
A2  (via drill 0.5)
  Top 0.254: 153.29,83.31 SJ_A2.2 | v152.02,83.31 153.29,83.31 | 153.29,83.31 R59.2 | U14.3 131.57,78.49 131.06,78.99 129.16,78.99 128.78,79.38 v128.78,80.39
  Bottom 0.254: v152.02,83.31 152.02,81.92 151.64,81.53 129.92,81.53 v128.78,80.39
A3  (via drill 0.5)
  Top 0.254: 150.75,83.31 SJ_A3.2 | v149.48,83.31 150.75,83.31 | 150.75,83.31 R58.2 | U14.4 130.82,77.84 v130.56,78.11
  Bottom 0.254: v149.48,83.31 149.48,82.55 148.97,82.04 129.16,82.04 127.51,80.39 127.51,78.99 128.4,78.11 v130.56,78.11
A4  (via drill 0.5)
  Top 0.254: 148.21,83.31 SJ_A4.2 | v146.94,83.31 148.21,83.31 | 148.21,83.31 R57.2 | v126.24,80.39 126.24,79.38 126.36,79.25 128.02,79.25 130.07,77.19 U14.5
  Bottom 0.254: v146.94,83.31 146.94,82.8 146.69,82.55 128.4,82.55 v126.24,80.39
A5
  Top 0.254: U14.24 141.96,77.19 144.02,79.25 144.02,80.9 144.65,81.53 145.5,81.53 R56.2 SJ_A5.2
CH1+
  pour Bottom (isolate 0.406): 15.88,1.27 15.88,15.24 22.23,15.24 22.23,1.27
  pour Top (isolate 0.406): 15.88,1.27 15.88,15.24 22.23,15.24 22.23,1.27
CH1-
  pour Top (isolate 0.406): 6.99,1.27 6.99,15.24 14.61,15.24 14.61,1.27
  pour Bottom (isolate 0.406): 6.99,1.27 6.99,15.24 14.61,15.24 14.61,1.27
CH2+
  pour Bottom (isolate 0.406): 32.38,1.27 32.38,15.24 38.73,15.24 38.73,1.27
  pour Top (isolate 0.406): 32.38,1.27 32.38,15.24 38.73,15.24 38.73,1.27
CH2-
  pour Top (isolate 0.406): 23.5,1.27 23.5,15.24 31.11,15.24 31.11,1.27
  pour Bottom (isolate 0.406): 23.5,1.27 23.5,15.24 31.11,15.24 31.11,1.27
CH3+
  pour Bottom (isolate 0.406): 48.9,1.27 48.9,15.24 55.24,15.24 55.24,1.27
  pour Top (isolate 0.406): 48.9,1.27 48.9,15.24 55.24,15.24 55.24,1.27
CH3-
  pour Top (isolate 0.406): 40.01,1.27 40.01,15.24 47.62,15.24 47.62,1.27
  pour Bottom (isolate 0.406): 40.01,1.27 40.01,15.24 47.62,15.24 47.62,1.27
CH4+
  pour Bottom (isolate 0.406): 65.41,1.27 65.41,15.24 71.75,15.24 71.75,1.27
  pour Top (isolate 0.406): 65.41,1.27 65.41,15.24 71.75,15.24 71.75,1.27
CH4-
  pour Top (isolate 0.406): 56.52,1.27 56.52,15.24 64.14,15.24 64.14,1.27
  pour Bottom (isolate 0.406): 56.52,1.27 56.52,15.24 64.14,15.24 64.14,1.27
CH5+
  pour Bottom (isolate 0.406): 81.92,1.27 81.92,15.24 88.27,15.24 88.27,1.27
  pour Top (isolate 0.406): 81.92,1.27 81.92,15.24 88.27,15.24 88.27,1.27
CH5-
  pour Top (isolate 0.406): 73.03,1.27 73.03,15.24 80.64,15.24 80.64,1.27
  pour Bottom (isolate 0.406): 73.03,1.27 73.03,15.24 80.64,15.24 80.64,1.27
CH6+
  pour Bottom (isolate 0.406): 98.42,1.27 98.42,15.24 107.31,15.24 107.31,1.27
  pour Top (isolate 0.406): 98.42,1.27 98.42,15.24 107.31,15.24 107.31,1.27
CH6-
  pour Top (isolate 0.406): 89.53,1.27 89.53,15.24 97.16,15.24 97.16,1.27
  pour Bottom (isolate 0.406): 89.53,1.27 89.53,15.24 97.16,15.24 97.16,1.27
DAC_!CLR!  (1 unrouted)
  Top 0.305: U7.9 69.71,47.76 70.5,46.97 R25.2 R24.2
  Top 0.356: 68.97,47.76 U7.9
DIM1  (via drill 0.35)
  Top 0.305: U7.4 60.9,50.36 58.8,48.26 56.52,48.26 55.88,47.62 40.39,47.62 39.75,46.99 31.97,46.99 31.11,46.14 v31.11,46.1 | R6.2 v50.67,50.55
  Bottom 0.305: U1.2 16.51,31.5 v31.11,46.1 39.57,46.1 40.33,46.86 46.99,46.86 v50.67,50.55
DIM2  (via drill 0.35)
  Top 0.305: 62.72,49.7 U7.5 61.27,49.71 59.1,47.55 56.8,47.55 56.2,46.94 44.27,46.94 43.31,45.97 40.77,45.97 v40.64,46.1 | R7.2 v52.7,50.55
  Bottom 0.305: U2.2 33.02,38.48 v40.64,46.1 48.26,46.1 v52.7,50.55
DIM3  (via drill 0.35)
  Top 0.305: U7.6 62.72,49.05 61.52,49.05 59.41,46.94 57.06,46.94 56.22,46.1 v49.53,46.1 | R8.2 v54.74,50.55
  Bottom 0.305: U3.2 v49.53,46.1 50.29,46.1 v54.74,50.55
DIM4  (via drill 0.35)
  Top 0.305: U7.7 61.75,48.41 59.56,46.23 57.53,46.23 v57.4,46.1 | R9.2 v56.77,50.55
  Top 0.356: 62.69,48.37 U7.7
  Bottom 0.305: U4.2 57.4,37.85 v57.4,46.1 57.4,49.91 v56.77,50.55
DIM5  (via drill 0.35)
  Top 0.305: U7.10 70.08,48.41 v73.91,44.58 | v79.12,46.74 R14.2
  Bottom 0.305: U5.2 82.55,35.94 v73.91,44.58 76.96,44.58 v79.12,46.74
DIM6  (via drill 0.35)
  Top 0.305: U7.11 72.22,49.06 77.72,44.07 v81.28,44.07 81.92,44.7 R26.2
  Bottom 0.305: U6.2 84.2,44.07 v81.28,44.07
GND  (via drill 0.35)  (11 unrouted)
  Top 0.254: 153.26,79.81 R59.1
  Top 0.305: U7.14 69.79,51.01 v70.1,50.7
  other vias: 74.04,64.77 51.31,66.93 67.06,64.64 59.82,54.64 8.38,58.57 29.08,48.79
  pour Bottom (isolate 0.406): 23.5,16.51 6.35,16.51 6.35,36.83 23.5,36.83
  pour Top (isolate 0.406, rank 2): 6.35,16.51 6.35,36.83 23.5,36.83 23.5,16.51
  pour Bottom (isolate 0.406): 40.01,16.51 23.5,16.51 23.5,36.83 40.01,36.83
  pour Top (isolate 0.406, rank 2): 23.5,16.51 23.5,36.83 40.01,36.83 40.01,16.51
  pour Bottom (isolate 0.406): 56.52,16.51 40.01,16.51 40.01,36.83 56.52,36.83
  pour Top (isolate 0.406, rank 2): 40.01,16.51 40.01,36.83 56.52,36.83 56.52,16.51
  pour Bottom (isolate 0.406): 73.03,16.51 56.52,16.51 56.52,36.83 73.03,36.83
  pour Top (isolate 0.406, rank 2): 56.52,16.51 56.52,36.83 73.03,36.83 73.03,16.51
  pour Bottom (isolate 0.406): 89.53,16.51 73.03,16.51 73.03,36.83 89.53,36.83
  pour Top (isolate 0.406, rank 2): 73.03,16.51 73.03,36.83 89.53,36.83 89.53,16.51
  pour Bottom (isolate 0.406): 106.05,16.51 89.53,16.51 89.53,36.83 106.05,36.83
  pour Top (isolate 0.406, rank 2): 89.53,16.51 89.53,36.83 107.31,36.83 107.31,16.51
  pour Top (isolate 0.406, rank 3): 0,38.1 114.3,38.1 114.3,114.3 0,114.3
  pour Bottom (isolate 0.406, rank 3): 0,15.88 114.3,15.88 114.3,114.3 0,114.3
  pour Top (isolate 0.406): 73.03,69.09 79.88,69.09 79.88,66.55 86.23,66.55 86.23,62.23 73.03,62.23
  pour Bottom (isolate 0.406): 73.03,69.09 79.88,69.09 79.88,66.55 86.23,66.55 86.23,62.23 73.03,62.23
  pour Top (isolate 0.406): 51.44,62.23 71.75,62.23 71.75,67.82 51.44,67.82
  pour Bottom (isolate 0.406): 71.75,67.82 51.44,67.82 51.44,62.23 71.75,62.23
  pour Top (isolate 0.356): 59.31,55.12 70.74,55.12 70.74,47.5 59.31,47.5
  pour Top (isolate 0.406): 28.57,45.72 28.57,57.15 10.79,57.15 10.79,45.72
  pour Top: 7.62,90.81 48.9,81.28 50.16,59.69 7.62,67.94
  pour Bottom (isolate 0.406): 7.62,67.94 7.62,90.81 48.9,81.28 50.16,59.69
  pour Bottom: 59.31,55.12 70.74,55.12 70.74,47.5 59.31,47.5
  pour Top (isolate 0.406): 96.14,66.04 96.14,46.99 99.69,46.99 99.69,66.04
  pour Bottom (isolate 0.406): 96.14,66.29 96.14,47.24 106.05,46.99 106.05,66.04
I2C_3V3  (4 unrouted)
  Top 0.305: U8.1 85.09,71.25
  Top 0.61: 85.25,68.34 U8.1 87.16,68.5 R13.2 R12.2 91.05,68.85 C24.1
I2C_GND  (5 unrouted)
I2C_IO  (2 unrouted)
I2C_SCL  (4 unrouted)
  Top 0.305: R12.1 88.11,66.38 arc-45 87.66,66.19 84.21,66.19 arc-45 83.76,66.38 82.55,67.59 U8.3 82.68,68.63
I2C_SDA  (4 unrouted)
  Top 0.305: U8.2 83.82,67.45 arc45 84.01,67 84.02,66.99 arc45 84.46,66.8 86.75,66.8 arc45 87.2,66.99 R13.1
N$1
  pour Top (isolate 0.406): 15.88,24.13 15.88,36.83 23.5,36.83 23.5,24.13
N$2
  pour Top (isolate 0.406): 32.38,24.13 32.38,36.83 40.01,36.83 40.01,24.13
N$3  (1 unrouted)
N$4
  pour Top (isolate 0.406): 48.9,24.13 48.9,36.83 56.52,36.83 56.52,24.13
N$5
  pour Top (isolate 0.406): 65.41,24.13 65.41,36.83 73.03,36.83 73.03,24.13
N$6
  pour Top (isolate 0.406): 81.92,24.13 81.92,36.83 89.53,36.83 89.53,24.13
N$7
  pour Top (isolate 0.406): 98.42,24.13 98.42,36.83 107.31,36.83 107.31,24.13
N$8  (via drill 0.35)
  Top 0.406: C34.1 10.73,75.06 | 12.83,75.14 C30.1
  Top 0.61: R17.1 51.94,64.01 v51.44,64.52 | v12.83,73.15 12.74,73.24 C30.1
  Top 0.762: C30.1 10.73,75.06 | U11.24 12.83,75.14
  Bottom 0.61: v51.44,64.52 42.8,73.15 v12.83,73.15
N$23
  Top 0.305: U9.26 18.8,48.51 20.32,50.04 24.26,50.04 24.13,50.17 C33.1
OE  (1 unrouted)
P0[7]  (via drill 0.35)
  Top 0.305: R25.1 67.56,44.97 v67.56,44.96 | U9.24 17.5,49.88 v17.91,50.29
  Bottom 0.305: v17.91,50.29 18.41,50.29 21.21,47.5 46.55,47.5 50.36,51.3 61.22,51.3 v67.56,44.96
P2[6]
  Top 0.305: R20.1 60.88,58.32 43.91,58.32 41.98,56.39 15.62,56.39 14.9,55.67 U9.9
P2[7]
  Top 0.305: R21.1 60.04,59.01 43.74,59.01 41.78,57.05 15.27,57.05 14.25,56.03 U9.10
PHOTON_A0
  Top 0.305: U11.12 39.37,59.56 11.81,59.56 8.66,56.41 8.66,45.31 10.03,43.94 68.18,43.94 R24.1
PHOTON_D2  (via drill 0.35)
  Top 0.305: 70.5,66.14 R23.1 71.07,66.61 71.11,66.61 71.5,67 71.5,68.07 71.44,68.14 71.44,68.19 70.29,69.34 51.69,69.34 51.18,69.85 51.18,79.25 48.39,82.04 v37.97,82.04
  Bottom 0.305: U11.15 35.69,80.01 v37.97,82.04
PHOTON_D3  (via drill 0.35)
  Top 0.305: v35.43,82.04 36.54,82.04 37.37,82.88 48.57,82.88 51.94,79.5 51.94,70.87 52.7,70.1 70.39,70.1 72.11,68.38 72.11,66.08 71.11,65.08 71.07,65.08 R22.1
  Bottom 0.305: U11.16 33.15,80.01 v35.43,82.04
PHOTON_RX
  Top 0.305: U11.4 18.06,63.35 8,63.35 8.18,73.33 8.18,88.31 9.78,81.03 48.39,81.03 50.42,78.99 50.42,69.6 51.44,68.58 69.98,68.58 70.5,68.06 R18.1
PHOTON_SCL
  Top 0.305: 62.47,46.23 R5.1 62.23,46.35 61.04,45.16 11.1,45.16 10.03,46.23 10.03,55.63 12.75,58.34 41.3,58.34 41.45,58.5 | U11.14 38.79,78.74 40.19,80.14 48.11,80.14 49.51,78.74 49.51,60.96 48.89,60.35 43.31,60.35 | 43.31,60.35 | 41.45,58.5 43.31,60.35 | 41.45,58.5 41.3,58.34
PHOTON_SDA
  Top 0.305: R4.1 62.19,44.55 10.29,44.55 | U11.13 48.64,78.74 48.9,78.49 48.9,61.21 48.64,60.96 43.05,60.96 41.05,58.95 12.06,58.95 9.27,56.16 9.27,45.57 10.29,44.55 | 10.29,44.55
PHOTON_TX
  Top 0.305: U11.3 16.13,62.74 8.38,72.26 7.52,73.13 7.52,88.67 9.61,81.87 33.83,81.87 | 70.5,63.09 R19.1 71.07,63.56 71.11,63.56 72.72,65.17 72.72,68.64 70.64,70.71 53.11,70.71 52.55,71.27 52.55,79.75 48.82,83.49 35.44,83.49 33.83,81.87 | 33.74,81.79 33.83,81.87
PWM1  (1 unrouted)
PWM2  (1 unrouted)
PWM3  (1 unrouted)
PWM4  (1 unrouted)
PWM5  (1 unrouted)
PWM6  (1 unrouted)
REG_3V3  (1 unrouted)
SCB0_I2C_SCL
  Top 0.305: U9.15 11.65,49.12 14.25,51.71 20.84,51.71 22.17,53.04 22.17,54.3 22.43,54.56 42.74,54.56 44.67,56.49 62.86,56.49 67.22,60.86 73.53,60.86 75.92,63.25 R2.1
SCB0_I2C_SDA
  Top 0.305: R1.1 76.58,64.77 73.28,61.47 66.97,61.47 62.6,57.1 44.42,57.1 42.49,55.17 22.02,55.17 21.57,54.71 21.57,53.3 20.59,52.32 13.84,52.32 10.79,49.28 10.79,46.48 11.3,45.97 12.06,45.97 12.3,46.21 U9.16
SCB1_RX[0]
  Top 0.305: R15.1 59.2,59.69 43.56,59.69 41.53,57.66 15.52,57.66 | U9.11 13.6,56.4 14.86,57.66 15.01,57.66 | 15.52,57.66 | 15.52,57.66 15.01,57.66 | 15.01,57.66
SCB1_TX[0]
  Top 0.305: U9.12 12.95,53.22 13.21,52.96 20.37,52.96 20.77,53.37 20.77,53.41 20.95,53.59 20.95,55.12 21.61,55.78 42.24,55.78 44.17,57.71 61.69,57.71 64.03,60.05 R16.1
SCL  (1 unrouted)
  Top 0.305: R5.2 66.04,46.35 66.57,46.89 66.57,51.29 67.6,52.31 U7.16 73.27,52.31 75.06,54.1 | R2.2 78.88,63.26 80.64,65.02 81.92,65.02 82.55,64.39 U8.6 82.55,61.59 75.06,54.1 | R10.1 75.06,54.1
SDA  (1 unrouted)
  Top 0.305: R4.2 66.17,44.96 67.18,45.97 67.18,51.03 67.8,51.65 68.57,51.65 U7.15 73.63,51.66 81.41,59.44 | R1.2 79.75,65.63 82.41,65.63 83.82,64.22 U8.7 83.82,61.85 81.41,59.44 | R11.1 81.41,59.44
SWD_CLK[0]  (via drill 0.35)
  Top 0.305: U9.14 11.65,56.23 12.93,57.51 v13.34,57.51
  Bottom 0.305: J1.2 34.06,57.51 v13.34,57.51
SWD_IO[0]  (via drill 0.35)
  Top 0.305: U9.13 12.3,55.67 v12.77,56.13
  Bottom 0.305: J1.1 32.89,56.13 v12.77,56.13
UART_!RE!
  Top 0.305: R23.2 68.06,66.67 61.72,66.67 60.96,65.91 U10.4 60.96,61.74 R21.2
UART_DE
  Top 0.305: R22.2 67.17,66.04 62.48,66.04 62.23,65.79 U10.5 62.23,62.87 62.61,62.48 R20.2
UART_RX
  Top 0.305: R18.2 61.34,67.56 59.69,65.91 U10.3 59.69,61.74 R15.2
UART_TX
  Top 0.305: U10.6 63.5,62.99 64.01,62.48 | 64.01,62.48 64.14,62.36 R16.2 | R19.2 68.44,62.48 64.01,62.48
VCC  (2 unrouted)
  Top 0.254: 128.78,81.41 128.81,81.44
  Top 0.305: 138.81,81.28 U14.28
  Top 0.406: SJ_A0.1 SJ_A1.1 SJ_A2.1 SJ_A3.1 SJ_A4.1 SJ_A5.1 145.64,86.49 144.27,86.49 143.89,86.11 143.89,82.04 143.26,81.41 138.68,81.41 138.81,81.28
VDDD
  Top 0.305: U9.27 19.45,46.21 19.68,45.97 22.57,45.97 C31.1 23.79,46.27 C32.1
  Top 0.61: C32.1 26.59,45.92 29.54,45.92 32.26,48.9 45.47,48.9 47.62,51.05 J1.5 49.78,49.4 R3.2
XRES
  Top 0.305: J1.3 42.55,52.58 41.27,53.85 23.84,53.85 21.1,51.1 20.5,51.1 18.15,48.76 U9.25

### Text on the board
tPlace: RS485 | I2C | I2C | I2C | 1+ | A5 | A4 | A3 | A2 | A1 | A0 | +RW | GND | 24V | PCA9685
bPlace: Use V+ for servo supply